# Altium project PCB_Project.PrjPcb
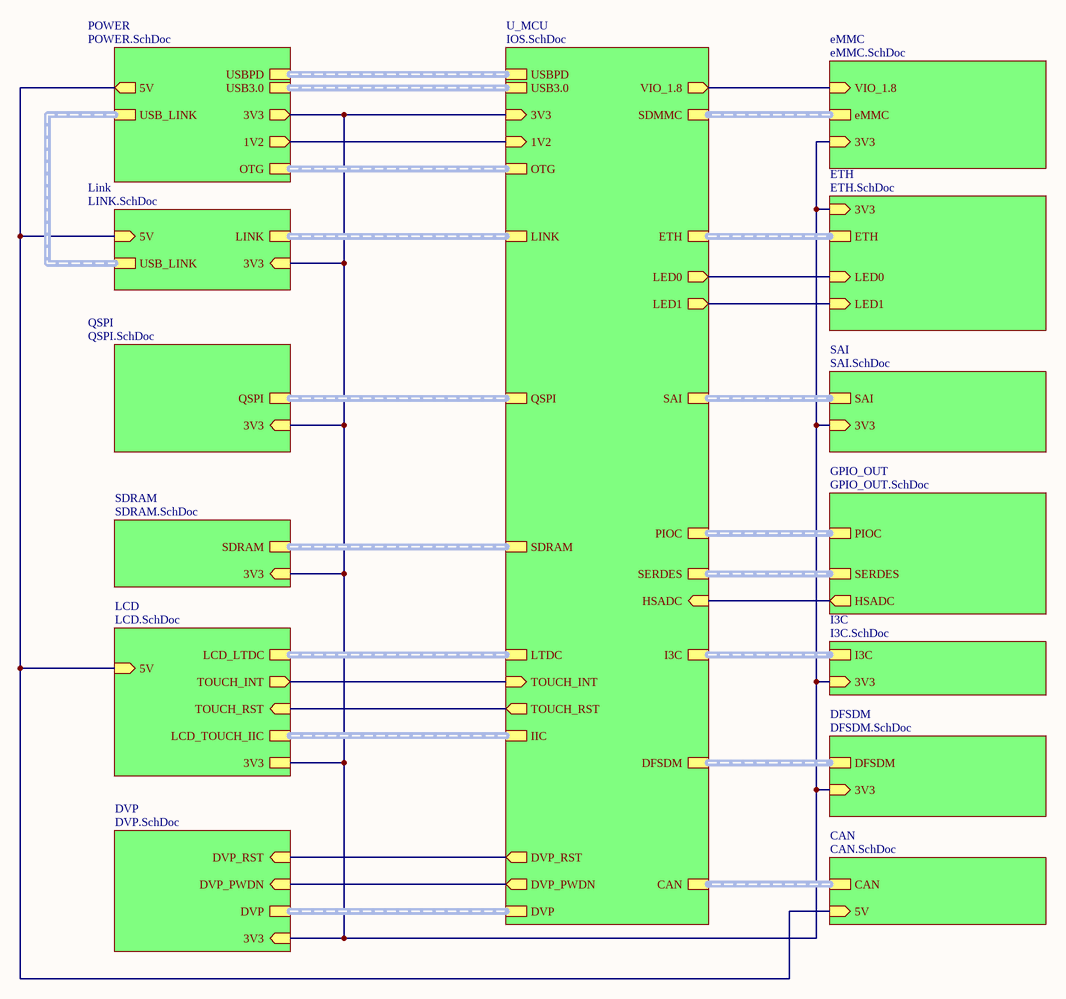
[diagram p0: TOP.SchDoc]
15 sheets, 263 parts. Net scope: hierarchical (ports join the sheet entries above them; power ports are global).
Sheets:
  TOP.SchDoc
    POWER = POWER.SchDoc
    U_MCU = IOS.SchDoc
    Link = LINK.SchDoc
    QSPI = QSPI.SchDoc
    SDRAM = SDRAM.SchDoc
    LCD = LCD.SchDoc
    eMMC = eMMC.SchDoc
    DVP = DVP.SchDoc
    ETH = ETH.SchDoc
    SAI = SAI.SchDoc
    I3C = I3C.SchDoc
    DFSDM = DFSDM.SchDoc
    CAN = CAN.SchDoc
    GPIO_OUT = GPIO_OUT.SchDoc

## Sheet TOP.SchDoc
size A3; DocumentNumber: 1; SheetNumber: 1; SheetTotal: 15

### Sub-sheets
CAN = CAN.SchDoc: CAN (harness CAN), 5V (in)
DFSDM = DFSDM.SchDoc: DFSDM (harness DFSDM), 3V3 (in)
DVP = DVP.SchDoc: DVP (harness DVP), DVP_RST (in), DVP_PWDN (in), 3V3 (in)
eMMC = eMMC.SchDoc: eMMC (harness eMMC), 3V3 (in), VIO_1.8 (in)
ETH = ETH.SchDoc: ETH (harness ETH), LED0 (in), LED1 (in), 3V3 (in)
GPIO_OUT = GPIO_OUT.SchDoc: PIOC (harness PIOC), SERDES (harness SERDES), HSADC (out)
I3C = I3C.SchDoc: I3C (harness I3C), 3V3 (in)
LCD = LCD.SchDoc: LCD_LTDC (harness LCD_LTDC), LCD_TOUCH_IIC (harness LCD_TOUCH_IIC), TOUCH_INT (out), TOUCH_RST (in), 3V3, 5V (in)
Link = LINK.SchDoc: LINK (harness LINK), USB_LINK (harness USB_LINK), 3V3 (in), 5V (in)
POWER = POWER.SchDoc: USB_LINK (harness USB_LINK), USB3.0 (harness USB3.0), 3V3 (out), 1V2 (out), OTG (harness OTG), 5V (out), USBPD (harness USBPD)
QSPI = QSPI.SchDoc: QSPI (harness QSPI), 3V3 (in)
SAI = SAI.SchDoc: SAI (harness SAI), 3V3 (in)
SDRAM = SDRAM.SchDoc: SDRAM (harness SDRAM), 3V3 (in)
U_MCU = IOS.SchDoc: QSPI (harness QSPI), LINK (harness LINK), SDRAM (harness SDRAM), LTDC (harness LCD_LTDC), USB3.0 (harness USB3.0), IIC (harness IIC), DVP (harness DVP), TOUCH_INT (in), TOUCH_RST (out), DVP_RST (out), DVP_PWDN (out), SDMMC (harness eMMC), ETH (harness ETH), SAI (harness SAI), I3C (harness I3C), DFSDM (harness DFSDM), 3V3 (in), 1V2 (in), LED0 (out), LED1 (out), VIO_1.8 (out), OTG (harness OTG), USBPD (harness USBPD), HSADC (in), PIOC (harness PIOC), SERDES (harness SERDES), CAN

### Nets
1V2: sheet POWER/1V2, sheet U_MCU/1V2
3V3: sheet POWER/3V3, sheet U_MCU/3V3, sheet Link/3V3, sheet QSPI/3V3, sheet SDRAM/3V3, sheet LCD/3V3, sheet eMMC/3V3, sheet DVP/3V3, sheet ETH/3V3, sheet SAI/3V3, sheet I3C/3V3, sheet DFSDM/3V3
5V: sheet POWER/5V, sheet Link/5V, sheet LCD/5V, sheet CAN/5V
VIO_1.8: sheet U_MCU/VIO_1.8, sheet eMMC/VIO_1.8
DVP_PWDN: sheet U_MCU/DVP_PWDN, sheet DVP/DVP_PWDN
DVP_RESET: sheet U_MCU/DVP_RST, sheet DVP/DVP_RST
ELED0: sheet U_MCU/LED0, sheet ETH/LED0
ELED1: sheet U_MCU/LED1, sheet ETH/LED1
HSADC: sheet U_MCU/HSADC, sheet GPIO_OUT/HSADC
TOUCH_INT: sheet U_MCU/TOUCH_INT, sheet LCD/TOUCH_INT
TOUCH_RST: sheet U_MCU/TOUCH_RST, sheet LCD/TOUCH_RST

### Buses and harness runs
harness sheet CAN/CAN = sheet U_MCU/CAN
harness sheet DFSDM/DFSDM = sheet U_MCU/DFSDM
harness sheet DVP/DVP = sheet U_MCU/DVP
harness sheet eMMC/eMMC = sheet U_MCU/SDMMC
harness sheet ETH/ETH = sheet U_MCU/ETH
harness sheet GPIO_OUT/PIOC = sheet U_MCU/PIOC
harness sheet GPIO_OUT/SERDES = sheet U_MCU/SERDES
harness sheet I3C/I3C = sheet U_MCU/I3C
harness sheet LCD/LCD_LTDC = sheet U_MCU/LTDC
harness sheet LCD/LCD_TOUCH_IIC = sheet U_MCU/IIC
harness sheet Link/LINK = sheet U_MCU/LINK
harness sheet Link/USB_LINK = sheet POWER/USB_LINK
harness sheet POWER/OTG = sheet U_MCU/OTG
harness sheet POWER/USB3.0 = sheet U_MCU/USB3.0
harness sheet POWER/USBPD = sheet U_MCU/USBPD
harness sheet QSPI/QSPI = sheet U_MCU/QSPI
harness sheet SAI/SAI = sheet U_MCU/SAI
harness sheet SDRAM/SDRAM = sheet U_MCU/SDRAM

## Sheet POWER.SchDoc: POWER
size A4; DocumentNumber: 2; SheetNumber: 2; SheetTotal: 15
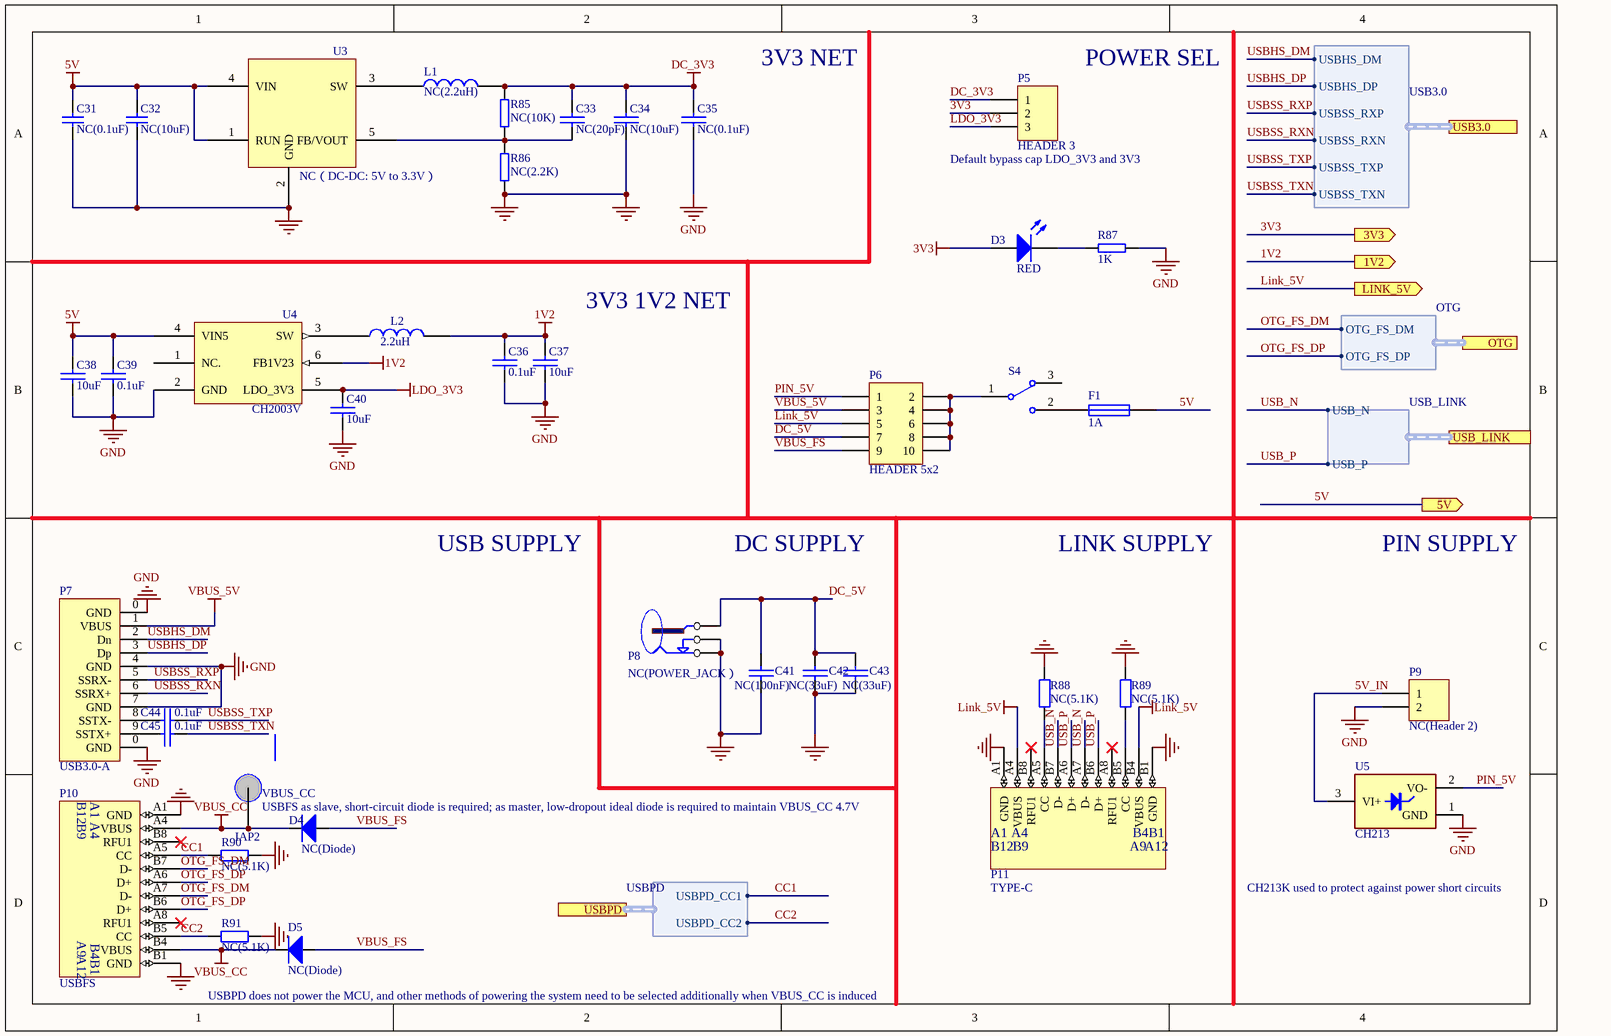
[diagram p1: POWER.SchDoc]

### Parts
C31  NC(0.1uF)  [0402_C]
C32  NC(10uF)  [0603_C]
C33  NC(20pF)  [0402_C]
C34  NC(10uF)  [0603_C]
C35  NC(0.1uF)  [0402_C]
C36  0.1uF  [0402_C]
C37  10uF  [0603_C]
C38  10uF  [0603_C]
C39  0.1uF  [0402_C]
C40  10uF  [0603_C]
C41  NC(100nF)  [0402_C]
C42  NC(33uF)  [3528_C]
C43  NC(33uF)  [3528_C]
C44  0.1uF  [0402_C]
C45  0.1uF  [0402_C]
D3  RED  [0603+]
D4  NC(Diode)  [SOD-323]
D5  NC(Diode)  [SOD-323]
F1  1A  [0805]
IAP2  VBUS_CC  [TESTPOINT1]
L1  NC(2.2uH)  [CD32]
L2  2.2uH  [CD32]
P5  HEADER 3  [SIP3-2.54MM]
P6  HEADER 5x2  [IDC10-2.54mm]
P7  USB3.0-A  [USB3.0-A-Receptacle]
P8  NC(POWER_JACK）  [DC-005]
P9  NC(Header 2)  [SIP2-2.54mm]
P10  USBFS  [TYPE-C-Receptacle-2.0]
P11  TYPE-C  [TYPE-C-Receptacle-2.0]
R85  NC(10K)  [0402]
R86  NC(2.2K)  [0402]
R87  1K  [0402]
R88  NC(5.1K)  [0402]
R89  NC(5.1K)  [0402]
R90  NC(5.1K)  [0402]
R91  NC(5.1K)  [0402]
S4  SW-SPDT  [SW1]  (value not drawn)
U3  NC（DC-DC: 5V to 3.3V）  [SOT-23-5]
U4  CH2003V  [SOT-23-6]
U5  CH213  [SOT-23-3]

### Ports
1V2 (out), 3V3 (out), 5V (out), LINK_5V (out), OTG (harness OTG), USB3.0 (harness USB3.0), USB_LINK (harness USB_LINK), USBPD (harness USBPD)

### Harnesses
USB_LINK: USB_P, USB_N
USB3.0: USBHS_DM, USBHS_DP, USBSS_RXP, USBSS_RXN, USBSS_TXP, USBSS_TXN
OTG: OTG_FS_DP, OTG_FS_DM
USBPD: USBPD_CC1, USBPD_CC2

### Nets
1V2: C36.2 C37.2 L2.2 U4.6(FB1V23) ; port 1V2
3V3: D3.1(A) P5.2 ; port 3V3
5V: C31.2 C32.2 C38.2 C39.2 F1.1 U3.1(RUN) U3.4(VIN) U4.4(VIN5) ; port 5V
DC_3V3: C33.1 C34.1 C35.1 L1.2 P5.1 R85.1
GND: C31.1 C32.1 C34.2 C35.2 C36.1 C37.1 C38.1 C39.1 C40.1 C41.1 C42.1 C43.1 P7.0(GND) P7.4(GND) P7.7(GND) P8.2(G) P8.3(X) P9.2 P10.A1(GND) P10.B1(GND) P11.A1(GND) P11.B1(GND) R86.1 R87.2 R88.2 R89.2 R90.2 R91.2 U3.2(GND) U4.2(GND) U5.1(GND)
LDO_3V3: C40.2 P5.3 U4.5(LDO_3V3)
Link_5V: P6.5 P11.A4(VBUS) P11.B4(VBUS) ; port LINK_5V
VBUS_5V: P6.3 P7.1(VBUS)
VBUS_CC: D4.2(K) D5.2(K) IAP2.1(point) P10.A4(VBUS) P10.B4(VBUS)
5V_IN: P9.1 U5.3(VI+)
CC1: P10.A5(CC) R90.1 ; port USBPD.USBPD_CC1
CC2: P10.B5(CC) R91.1 ; port USBPD.USBPD_CC2
DC_5V: C41.2 C42.2 C43.2 P6.7 P8.1(V)
OTG_FS_DM: P10.A7(D-) P10.B7(D-) ; port OTG.OTG_FS_DM
OTG_FS_DP: P10.A6(D+) P10.B6(D+) ; port OTG.OTG_FS_DP
PIN_5V: P6.1 U5.2(VO-)
USB_N: P11.A7(D-) P11.B7(D-) ; port USB_LINK.USB_N
USB_P: P11.A6(D+) P11.B6(D+) ; port USB_LINK.USB_P
USBHS_DM: P7.2(Dn) ; port USB3.0.USBHS_DM  [project net DIO]
USBHS_DP: P7.3(Dp) ; port USB3.0.USBHS_DP  [project net CLK]
USBSS_RXN: P7.6(SSRX+) ; port USB3.0.USBSS_RXN
USBSS_RXP: P7.5(SSRX-) ; port USB3.0.USBSS_RXP
USBSS_TXN: C45.2 ; port USB3.0.USBSS_TXN
USBSS_TXP: C44.2 ; port USB3.0.USBSS_TXP
VBUS_FS: D4.1(A) D5.1(A) P6.9
NetC33_2: C33.2 R85.2 R86.2 U3.5(FB/VOUT)
NetC44_1: C44.1 P7.8(SSTX-)
NetC45_1: C45.1 P7.9(SSTX+)
NetD3_2: D3.2(K) R87.1
NetF1_2: F1.2 S4.2
NetL1_1: L1.1 U3.3(SW)
NetL2_1: L2.1 U4.3(SW)
NetP6_2: P6.2 P6.4 P6.6 P6.8 P6.10 S4.1
NetP11_A5: P11.A5(CC) R88.1
NetP11_B5: P11.B5(CC) R89.1

Not connected (* = marked no-connect by the designer): P10 A8(RFU1)* B8(RFU1)*; P11 A8(RFU1)* B8(RFU1)*; S4 3; U4 1(NC.)

### Notes on the sheet
- (near U3) Hot!!!
- 3V3 NET
- POWER SEL
- (near P5) Default bypass cap LDO_3V3 and 3V3
- 3V3 1V2 NET
- USB SUPPLY
- DC SUPPLY
- LINK SUPPLY
- PIN SUPPLY
- USBFS as slave, short-circuit diode is required; as master, low-dropout ideal diode is required to maintain VBUS_CC 4.7V
- CH213K used to protect against power short circuits
- USBPD does not power the MCU, and other methods of powering the system need to be selected additionally when VBUS_CC is induced
- (in symbol TYPE-C1) B12; B9; A9; A12

### Library data of the parts
C31 C32 = Cap: Capacitor; Published: 8-Jun-2000; LatestRevisionDate: 17-Jul-2002; LatestRevisionNote: Re-released for DXP Platform.; PackageReference: RAD-0.3; Publisher: Altium Limited; PackageDescription: Radial Cap, Thru-Hole; 2 Leads; 0.3 in Pin Spacing
C33-C45 = CAP: Capacitor
  C41: 容值: 100nF
  C42 C43: 容值: 33uF
D3 = LED0: Typical INFRARED GaAs LED; Published: 8-Jun-2000; LatestRevisionDate: 08-Jul-2005; LatestRevisionNote: Mech Layer 1 removed.; PackageReference: LED-0; Publisher: Altium Limited; PackageDescription: LED; 2 Leads
D4 D5 = Diode: Default Diode
F1 = FUSE1: Fuse
IAP2 = Testpoint: 测试点
L1 L2 = INDUCTOR
P5 = HEADER 3: Header, 3-Pin
P6 = HEADER 5x2: Header, 5-Pin, Dual row
P8 = POWER_JACK
P9 = Header 2: Header, 2-Pin; Publisher: Altium Limited
P10 P11 = TYPE-C1
R85 R86 = R
R87 = RES
R88-R91 = Res2: Resistor
S4 = SW-SPDT: SPDT Subminiature Toggle Switch, Right Angle Mounting, Vertical Actuation
U3 = 8503AM
U4 = CH2003V: Step-Down DC-DC Converter, 5V input, 1.23V * 700mA output, with LDO 3.3V * 160mA
U5 = CH213E: Ideal Diode 5V*1A

## Sheet IOS.SchDoc
size A3; DocumentNumber: 3; SheetNumber: 3; SheetTotal: 15
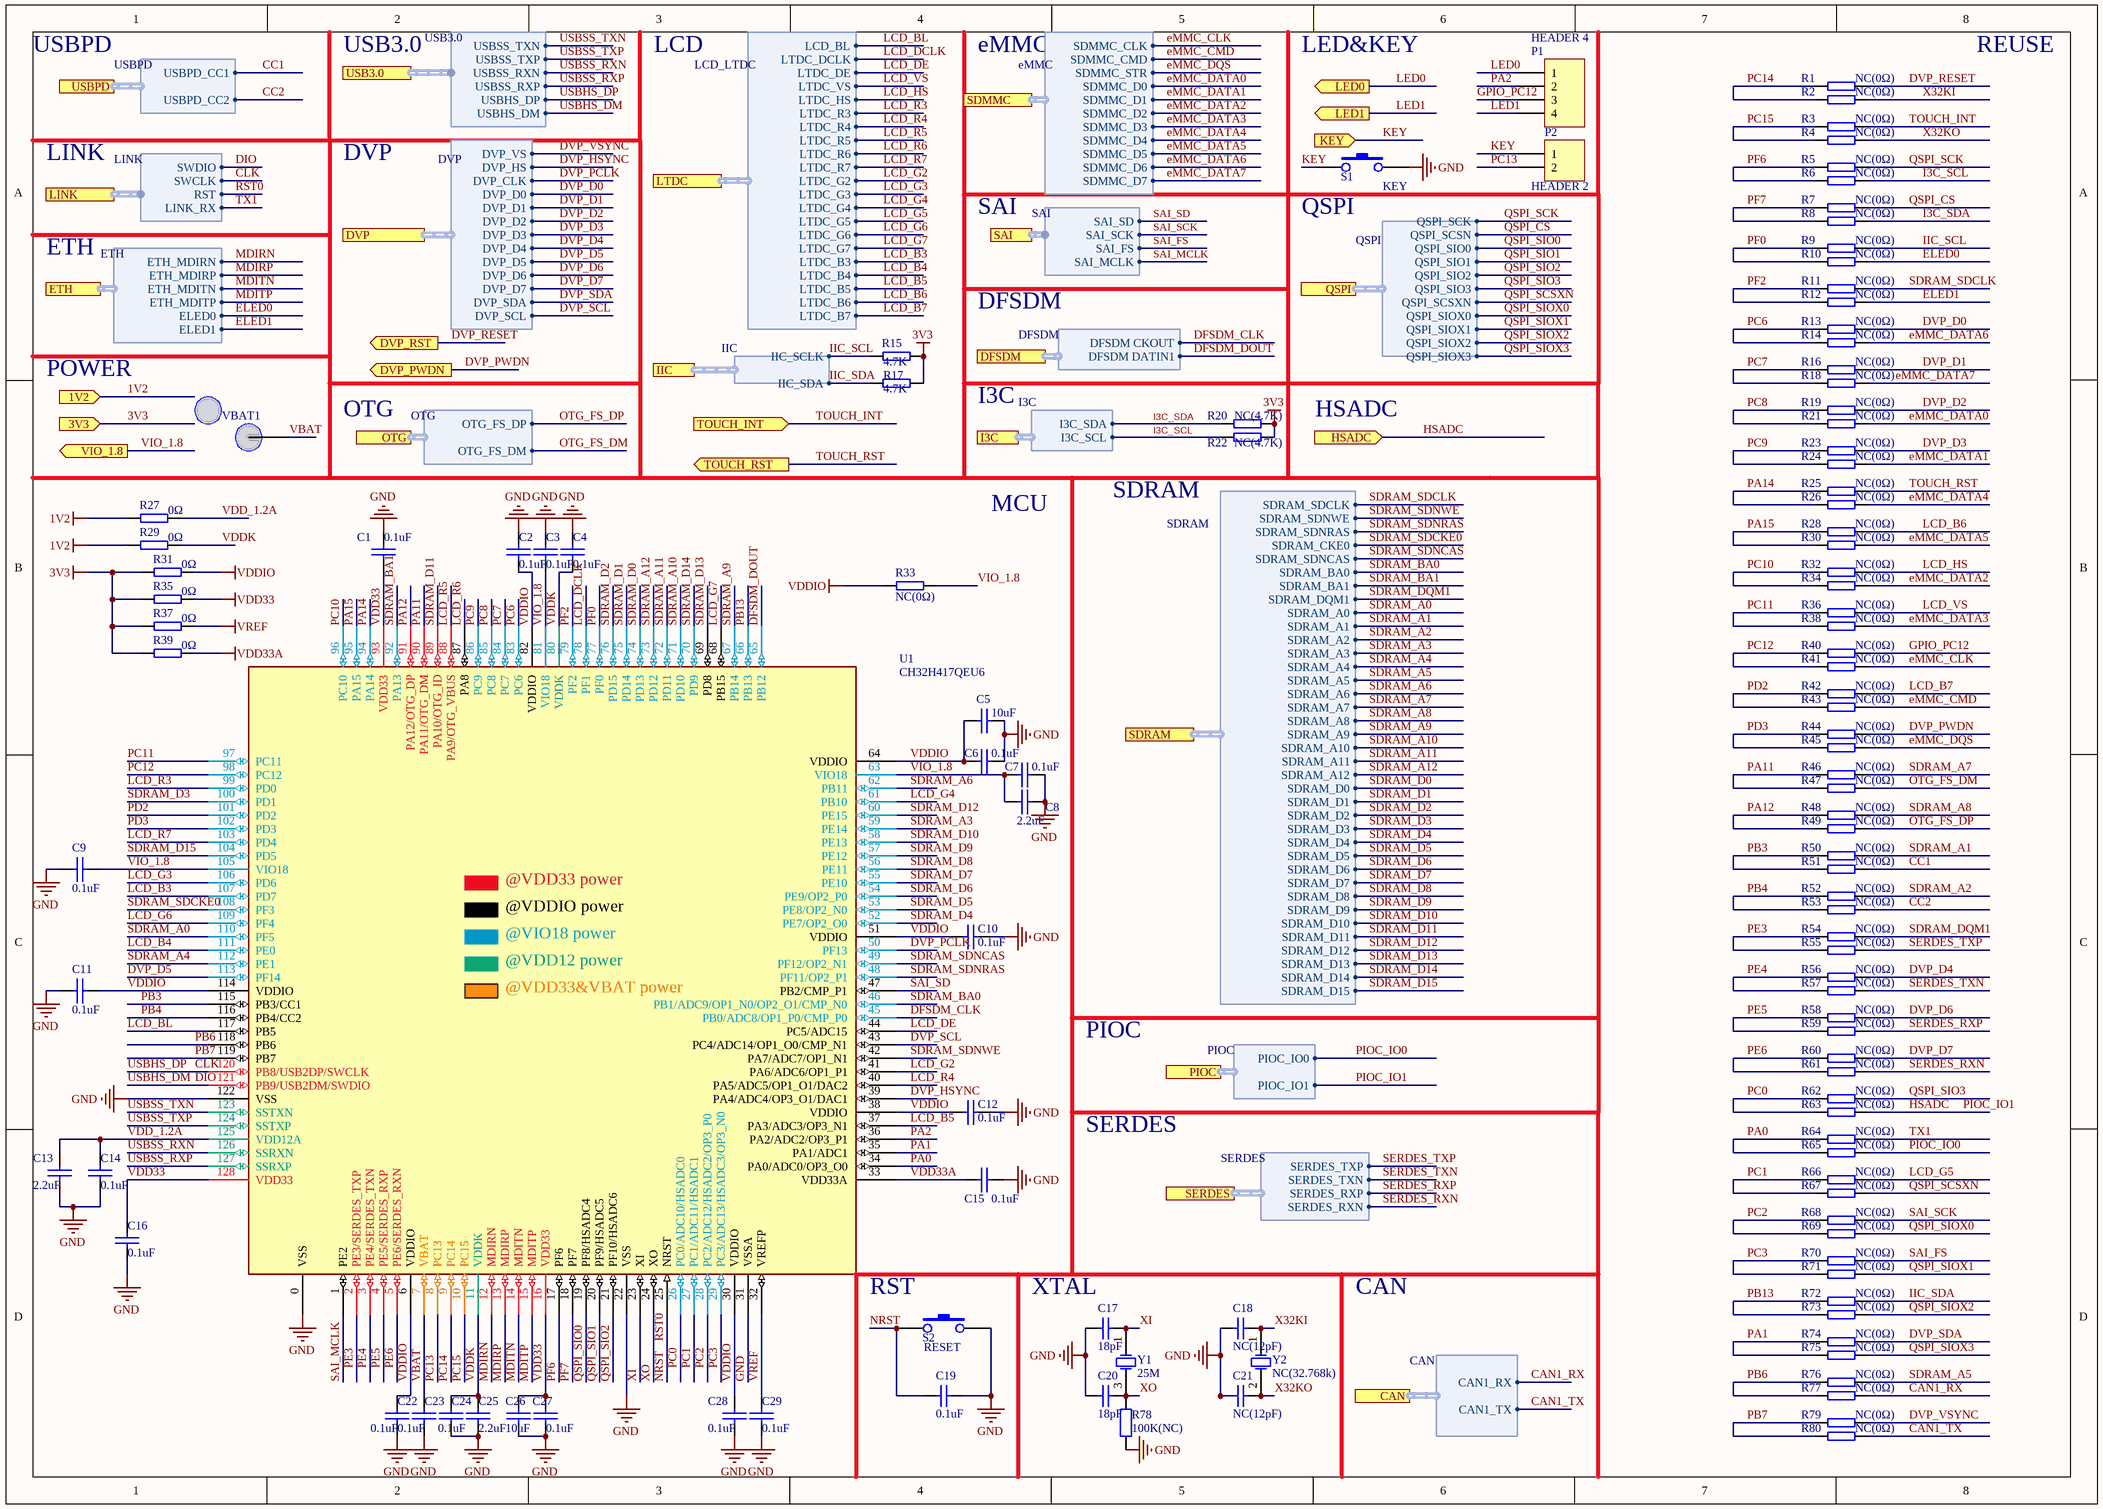
[diagram p2: IOS.SchDoc]

### Parts
C1  0.1uF  [0402_C]
C2  0.1uF  [0402_C]
C3  0.1uF  [0402_C]
C4  0.1uF  [0402_C]
C5  10uF  [0402_C]
C6  0.1uF  [0402_C]
C7  0.1uF  [0402_C]
C8  2.2uF  [0402_C]
C9  0.1uF  [0402_C]
C10  0.1uF  [0402_C]
C11  0.1uF  [0402_C]
C12  0.1uF  [0402_C]
C13  2.2uF  [0402_C]
C14  0.1uF  [0402_C]
C15  0.1uF  [0402_C]
C16  0.1uF  [0402_C]
C17  18pF  [0402_C]
C18  NC(12pF)  [0402_C]
C19  0.1uF  [0402_C]
C20  18pF  [0402_C]
C21  NC(12pF)  [0402_C]
C22  0.1uF  [0402_C]
C23  0.1uF  [0402_C]
C24  0.1uF  [0402_C]
C25  2.2uF  [0402_C]
C26  10uF  [0402_C]
C27  0.1uF  [0402_C]
C28  0.1uF  [0402_C]
C29  0.1uF  [0402_C]
P1  HEADER 4  [SIP4-2.54mm]
P2  HEADER 2  [SIP2-2.54mm]
R1  NC(0Ω)  [0402]
R2  NC(0Ω)  [0402]
R3  NC(0Ω)  [0402]
R4  NC(0Ω)  [0402]
R5  NC(0Ω)  [0402]
R6  NC(0Ω)  [0402]
R7  NC(0Ω)  [0402]
R8  NC(0Ω)  [0402]
R9  NC(0Ω)  [0402]
R10  NC(0Ω)  [0402]
R11  NC(0Ω)  [0402]
R12  NC(0Ω)  [0402]
R13  NC(0Ω)  [0402]
R14  NC(0Ω)  [0402]
R15  4.7K  [0402]
R16  NC(0Ω)  [0402]
R17  4.7K  [0402]
R18  NC(0Ω)  [0402]
R19  NC(0Ω)  [0402]
R20  NC(4.7K)  [0402]
R21  NC(0Ω)  [0402]
R22  NC(4.7K)  [0402]
R23  NC(0Ω)  [0402]
R24  NC(0Ω)  [0402]
R25  NC(0Ω)  [0402]
R26  NC(0Ω)  [0402]
R27  0Ω  [0402]
R28  NC(0Ω)  [0402]
R29  0Ω  [0402]
R30  NC(0Ω)  [0402]
R31  0Ω  [0402]
R32  NC(0Ω)  [0402]
R33  NC(0Ω)  [0402]
R34  NC(0Ω)  [0402]
R35  0Ω  [0402]
R36  NC(0Ω)  [0402]
R37  0Ω  [0402]
R38  NC(0Ω)  [0402]
R39  0Ω  [0402]
R40  NC(0Ω)  [0402]
R41  NC(0Ω)  [0402]
R42  NC(0Ω)  [0402]
R43  NC(0Ω)  [0402]
R44  NC(0Ω)  [0402]
R45  NC(0Ω)  [0402]
R46  NC(0Ω)  [0402]
R47  NC(0Ω)  [0402]
R48  NC(0Ω)  [0402]
R49  NC(0Ω)  [0402]
R50  NC(0Ω)  [0402]
R51  NC(0Ω)  [0402]
R52  NC(0Ω)  [0402]
R53  NC(0Ω)  [0402]
R54  NC(0Ω)  [0402]
R55  NC(0Ω)  [0402]
R56  NC(0Ω)  [0402]
R57  NC(0Ω)  [0402]
R58  NC(0Ω)  [0402]
R59  NC(0Ω)  [0402]
R60  NC(0Ω)  [0402]
R61  NC(0Ω)  [0402]
R62  NC(0Ω)  [0402]
R63  NC(0Ω)  [0402]
R64  NC(0Ω)  [0402]
R65  NC(0Ω)  [0402]
R66  NC(0Ω)  [0402]
R67  NC(0Ω)  [0402]
R68  NC(0Ω)  [0402]
R69  NC(0Ω)  [0402]
R70  NC(0Ω)  [0402]
R71  NC(0Ω)  [0402]
R72  NC(0Ω)  [0402]
R73  NC(0Ω)  [0402]
R74  NC(0Ω)  [0402]
R75  NC(0Ω)  [0402]
R76  NC(0Ω)  [0402]
R77  NC(0Ω)  [0402]
R78  100K(NC)  [0402]
R79  NC(0Ω)  [0402]
R80  NC(0Ω)  [0402]
S1  KEY  [贴片按键]
S2  RESET  [贴片按键]
U1  CH32H417QEU6  [QFN128_12.3X12.3]
VBAT1  Testpoint  [TESTPOINT2]  (value not drawn)
Y1  25M  [XT3225]
Y2  NC(32.768k)  [FC-135]

### Ports
1V2 (in), 3V3 (in), CAN (harness CAN), DFSDM (harness DFSDM), DVP (harness DVP), DVP_PWDN (out), DVP_RST (out), ETH (harness ETH), HSADC (in), I3C (harness I3C), IIC (harness IIC), KEY (in), LED0 (out), LED1 (out), LINK (harness LINK), LTDC (harness LCD_LTDC), OTG (harness OTG), PIOC (harness PIOC), QSPI (harness QSPI), SAI (harness SAI), SDMMC (harness eMMC), SDRAM (harness SDRAM), SERDES (harness SERDES), TOUCH_INT (in), TOUCH_RST (out), USB3.0 (harness USB3.0), USBPD (harness USBPD), VIO_1.8 (out)

### Harnesses
QSPI: QSPI_SCK, QSPI_SCSN, QSPI_SIO0, QSPI_SIO1, QSPI_SIO2, QSPI_SIO3, QSPI_SCSXN, QSPI_SIOX0, QSPI_SIOX1, QSPI_SIOX2, QSPI_SIOX3
USB3.0: USBHS_DM, USBHS_DP, USBSS_RXP, USBSS_RXN, USBSS_TXP, USBSS_TXN
SDRAM: SDRAM_SDNWE, SDRAM_SDNRAS, SDRAM_CKE0, SDRAM_SDNCAS, SDRAM_BA0, SDRAM_BA1, SDRAM_DQM1, SDRAM_A0, SDRAM_A1, SDRAM_A2, SDRAM_A3, SDRAM_A4, SDRAM_A5, SDRAM_A6, SDRAM_A7, SDRAM_A8, SDRAM_A9, SDRAM_A10, SDRAM_A11, SDRAM_A12, SDRAM_SDCLK, SDRAM_D0, SDRAM_D2, SDRAM_D3, SDRAM_D4, SDRAM_D5, SDRAM_D6, SDRAM_D7, SDRAM_D8, SDRAM_D9, SDRAM_D10, SDRAM_D11, SDRAM_D12, SDRAM_D13, SDRAM_D14, SDRAM_D15, SDRAM_D1
IIC: IIC_SCLK, IIC_SDA
LCD_LTDC: LCD_BL, LTDC_DCLK, LTDC_DE, LTDC_VS, LTDC_HS, LTDC_R3, LTDC_R4, LTDC_R5, LTDC_R6, LTDC_R7, LTDC_G2, LTDC_G3, LTDC_G4, LTDC_G5, LTDC_G6, LTDC_G7, LTDC_B3, LTDC_B4, LTDC_B5, LTDC_B6, LTDC_B7
DVP: DVP_VS, DVP_HS, DVP_CLK, DVP_D0, DVP_D1, DVP_D2, DVP_D3, DVP_D4, DVP_D5, DVP_D6, DVP_D7, DVP_SDA, DVP_SCL
eMMC: SDMMC_CLK, SDMMC_CMD, SDMMC_STR, SDMMC_D1, SDMMC_D0, SDMMC_D2, SDMMC_D3, SDMMC_D4, SDMMC_D5, SDMMC_D6, SDMMC_D7
LINK: SWDIO, SWCLK, RST, LINK_RX
ETH: ETH_MDIRN, ETH_MDIRP, ETH_MDITN, ETH_MDITP, ELED0, ELED1
DFSDM: DFSDM CKOUT, DFSDM DATIN1
SAI: SAI_SD, SAI_SCK, SAI_FS, SAI_MCLK
I3C: I3C_SDA, I3C_SCL
OTG: OTG_FS_DP, OTG_FS_DM
PIOC: PIOC_IO0, PIOC_IO1
SERDES: SERDES_TXP, SERDES_TXN, SERDES_RXP, SERDES_RXN
USBPD: USBPD_CC1, USBPD_CC2
CAN: CAN1_TX, CAN1_RX

### Nets
1V2: R27.2 R29.2 ; port 1V2
3V3: R15.2 R17.1 R20.2 R22.1 R31.2 R35.2 R37.2 R39.2 ; port 3V3
GND: C1.2 C2.2 C3.2 C4.2 C5.1 C6.2 C7.2 C8.1 C9.2 C10.2 C11.1 C12.1 C13.1 C14.1 C15.1 C16.1 C17.1 C18.2 C19.1 C20.1 C21.2 C22.1 C23.1 C24.1 C25.2 C26.1 C27.1 C28.2 C29.1 R78.1 S1.2 S2.2 U1.0(VSS) U1.22(VSS) U1.31(VSSA) U1.122(VSS)
VDD33: C1.1 C16.2 C26.2 C27.2 R35.1 U1.16(VDD33) U1.93(VDD33) U1.128(VDD33)
VDD33A: C15.2 R39.1 U1.33(VDD33A)
VDDIO: C2.1 C5.2 C6.1 C10.1 C11.2 C12.2 C22.2 C28.1 R31.1 R33.2 U1.6(VDDIO) U1.30(VDDIO) U1.38(VDDIO) U1.51(VDDIO) U1.64(VDDIO) U1.82(VDDIO) U1.114(VDDIO)
VIO_1.8: C3.1 C7.1 C8.2 C9.1 R33.1 U1.63(VIO18) U1.81(VIO18) U1.105(VIO18) ; port VIO_1.8
VREF: C29.2 R37.1 U1.32(VREFP)
CAN1_RX: R77.1 ; port CAN.CAN1_RX
CAN1_TX: R80.1 ; port CAN.CAN1_TX
CC1: R51.1 ; port USBPD.USBPD_CC1
CC2: R53.1 ; port USBPD.USBPD_CC2
CLK: U1.120(PB8/USB2DP/SWCLK) ; port USB3.0.USBHS_DP, port LINK.SWCLK  [also labelled USBHS_DP]
DFSDM_CLK: U1.45(PB0/ADC8/OP1_P0/CMP_P0) ; port DFSDM.DFSDM CKOUT  [project net DFS_CLK]
DFSDM_DOUT: U1.65(PB12) ; port DFSDM.DFSDM DATIN1  [project net DFS_DOUT]
DIO: U1.121(PB9/USB2DM/SWDIO) ; port USB3.0.USBHS_DM, port LINK.SWDIO  [also labelled USBHS_DM]
DVP_D0: R13.1 ; port DVP.DVP_D0
DVP_D1: R16.1 ; port DVP.DVP_D1
DVP_D2: R19.1 ; port DVP.DVP_D2
DVP_D3: R23.1 ; port DVP.DVP_D3
DVP_D4: R56.1 ; port DVP.DVP_D4
DVP_D5: U1.113(PF14) ; port DVP.DVP_D5
DVP_D6: R58.1 ; port DVP.DVP_D6
DVP_D7: R60.1 ; port DVP.DVP_D7
DVP_HSYNC: U1.39(PA4/ADC4/OP3_O1/DAC1) ; port DVP.DVP_HS
DVP_PCLK: U1.50(PF13) ; port DVP.DVP_CLK
DVP_PWDN: R44.1 ; port DVP_PWDN
DVP_RESET: R1.1 ; port DVP_RST
DVP_SCL: U1.43(PC4/ADC14/OP1_O0/CMP_N1) ; port DVP.DVP_SCL
DVP_SDA: R74.1 ; port DVP.DVP_SDA
DVP_VSYNC: R79.1 ; port DVP.DVP_VS
ELED0: P1.1 R10.1 ; port LED0, port ETH.ELED0  [also labelled LED0]
ELED1: P1.4 R12.1 ; port LED1, port ETH.ELED1  [also labelled LED1]
eMMC_CLK: R41.1 ; port SDMMC.SDMMC_CLK
eMMC_CMD: R43.1 ; port SDMMC.SDMMC_CMD
eMMC_DATA0: R21.1 ; port SDMMC.SDMMC_D0
eMMC_DATA1: R24.1 ; port SDMMC.SDMMC_D1
eMMC_DATA2: R34.1 ; port SDMMC.SDMMC_D2
eMMC_DATA3: R38.1 ; port SDMMC.SDMMC_D3
eMMC_DATA4: R26.1 ; port SDMMC.SDMMC_D4
eMMC_DATA5: R30.1 ; port SDMMC.SDMMC_D5
eMMC_DATA6: R14.1 ; port SDMMC.SDMMC_D6
eMMC_DATA7: R18.1 ; port SDMMC.SDMMC_D7
eMMC_DQS: R45.1 ; port SDMMC.SDMMC_STR
GPIO_PC12: P1.3 R40.1
HSADC: R63.1 ; port HSADC, port PIOC.PIOC_IO1  [also labelled PIOC_IO1]
I3C_SCL: R6.1 R22.2 ; port I3C.I3C_SCL
I3C_SDA: R8.1 R20.1 ; port I3C.I3C_SDA
IIC_SCL: R9.1 R15.1 ; port IIC.IIC_SCLK
IIC_SDA: R17.2 R72.1 ; port IIC.IIC_SDA
KEY: P2.1 S1.1 ; port KEY
LCD_B3: U1.107(PD7) ; port LTDC.LTDC_B3
LCD_B4: U1.111(PE0) ; port LTDC.LTDC_B4
LCD_B5: U1.37(PA3/ADC3/OP3_N1) ; port LTDC.LTDC_B5
LCD_B6: R28.1 ; port LTDC.LTDC_B6
LCD_B7: R42.1 ; port LTDC.LTDC_B7
LCD_BL: U1.117(PB5) ; port LTDC.LCD_BL
LCD_DCLK: U1.78(PF1) ; port LTDC.LTDC_DCLK
LCD_DE: U1.44(PC5/ADC15) ; port LTDC.LTDC_DE
LCD_G2: U1.41(PA6/ADC6/OP1_P1) ; port LTDC.LTDC_G2
LCD_G3: U1.106(PD6) ; port LTDC.LTDC_G3
LCD_G4: U1.61(PB10) ; port LTDC.LTDC_G4
LCD_G5: R66.1 ; port LTDC.LTDC_G5
LCD_G6: U1.109(PF4) ; port LTDC.LTDC_G6
LCD_G7: U1.68(PB15) ; port LTDC.LTDC_G7
LCD_HS: R32.1 ; port LTDC.LTDC_HS
LCD_R3: U1.99(PD0) ; port LTDC.LTDC_R3
LCD_R4: U1.40(PA5/ADC5/OP1_O1/DAC2) ; port LTDC.LTDC_R4
LCD_R5: U1.88(PA9/OTG_VBUS) ; port LTDC.LTDC_R5
LCD_R6: U1.87(PA8) ; port LTDC.LTDC_R6
LCD_R7: U1.103(PD4) ; port LTDC.LTDC_R7
LCD_VS: R36.1 ; port LTDC.LTDC_VS
MDIRN: U1.12(MDIRN) ; port ETH.ETH_MDIRN
MDIRP: U1.13(MDIRP) ; port ETH.ETH_MDIRP
MDITN: U1.14(MDITN) ; port ETH.ETH_MDITN
MDITP: U1.15(MDITP) ; port ETH.ETH_MDITP
NRST: C19.2 S2.1 U1.25(NRST) ; port LINK.RST  [also labelled RST0]
OTG_FS_DM: R47.1 ; port OTG.OTG_FS_DM
OTG_FS_DP: R49.1 ; port OTG.OTG_FS_DP
PA0: R64.2 R65.2 U1.34(PA0/ADC0/OP3_O0)
PA1: R74.2 R75.2 U1.35(PA1/ADC1)
PA2: P1.2 U1.36(PA2/ADC2/OP3_P1)
PA11: R46.2 R47.2 U1.90(PA11/OTG_DM)
PA12: R48.2 R49.2 U1.91(PA12/OTG_DP)
PA14: R25.2 R26.2 U1.94(PA14)
PA15: R28.2 R30.2 U1.95(PA15)
PB3: R50.2 R51.2 U1.115(PB3/CC1)
PB4: R52.2 R53.2 U1.116(PB4/CC2)
PB6: R76.2 R77.2 U1.118(PB6)
PB7: R79.2 R80.2 U1.119(PB7)
PB13: R72.2 R73.2 U1.66(PB13)
PC0: R62.2 R63.2 U1.26(PC0/ADC10/HSADC0)
PC1: R66.2 R67.2 U1.27(PC1/ADC11/HSADC1)
PC2: R68.2 R69.2 U1.28(PC2/ADC12/HSADC2/OP3_P0)
PC3: R70.2 R71.2 U1.29(PC3/ADC13/HSADC3/OP3_N0)
PC6: R13.2 R14.2 U1.83(PC6)
PC7: R16.2 R18.2 U1.84(PC7)
PC8: R19.2 R21.2 U1.85(PC8)
PC9: R23.2 R24.2 U1.86(PC9)
PC10: R32.2 R34.2 U1.96(PC10)
PC11: R36.2 R38.2 U1.97(PC11)
PC12: R40.2 R41.2 U1.98(PC12)
PC13: P2.2 U1.8(PC13)
PC14: R1.2 R2.2 U1.9(PC14)
PC15: R3.2 R4.2 U1.10(PC15)
PD2: R42.2 R43.2 U1.101(PD2)
PD3: R44.2 R45.2 U1.102(PD3)
PE3: R54.2 R55.2 U1.2(PE3/SERDES_TXP)
PE4: R56.2 R57.2 U1.3(PE4/SERDES_TXN)
PE5: R58.2 R59.2 U1.4(PE5/SERDES_RXP)
PE6: R60.2 R61.2 U1.5(PE6/SERDES_RXN)
PF0: R9.2 R10.2 U1.77(PF0)
PF2: R11.2 R12.2 U1.79(PF2)
PF6: R5.2 R6.2 U1.17(PF6)
PF7: R7.2 R8.2 U1.18(PF7)
PIOC_IO0: R65.1 ; port PIOC.PIOC_IO0
QSPI_CS: R7.1 ; port QSPI.QSPI_SCSN
QSPI_SCK: R5.1 ; port QSPI.QSPI_SCK
QSPI_SCSXN: R67.1 ; port QSPI.QSPI_SCSXN
QSPI_SIO0: U1.19(PF8/HSADC4) ; port QSPI.QSPI_SIO0
QSPI_SIO1: U1.20(PF9/HSADC5) ; port QSPI.QSPI_SIO1
QSPI_SIO2: U1.21(PF10/HSADC6) ; port QSPI.QSPI_SIO2
QSPI_SIO3: R62.1 ; port QSPI.QSPI_SIO3
QSPI_SIOX0: R69.1 ; port QSPI.QSPI_SIOX0
QSPI_SIOX1: R71.1 ; port QSPI.QSPI_SIOX1
QSPI_SIOX2: R73.1 ; port QSPI.QSPI_SIOX2
QSPI_SIOX3: R75.1 ; port QSPI.QSPI_SIOX3
SAI_FS: R70.1 ; port SAI.SAI_FS
SAI_MCLK: U1.1(PE2) ; port SAI.SAI_MCLK
SAI_SCK: R68.1 ; port SAI.SAI_SCK
SAI_SD: U1.47(PB2/CMP_P1) ; port SAI.SAI_SD
SDRAM_A0: U1.110(PF5) ; port SDRAM.SDRAM_A0
SDRAM_A1: R50.1 ; port SDRAM.SDRAM_A1
SDRAM_A2: R52.1 ; port SDRAM.SDRAM_A2
SDRAM_A3: U1.59(PE14) ; port SDRAM.SDRAM_A3
SDRAM_A4: U1.112(PE1) ; port SDRAM.SDRAM_A4
SDRAM_A5: R76.1 ; port SDRAM.SDRAM_A5
SDRAM_A6: U1.62(PB11) ; port SDRAM.SDRAM_A6
SDRAM_A7: R46.1 ; port SDRAM.SDRAM_A7
SDRAM_A8: R48.1 ; port SDRAM.SDRAM_A8
SDRAM_A9: U1.67(PB14) ; port SDRAM.SDRAM_A9
SDRAM_A10: U1.71(PD10) ; port SDRAM.SDRAM_A10
SDRAM_A11: U1.72(PD11) ; port SDRAM.SDRAM_A11
SDRAM_A12: U1.73(PD12) ; port SDRAM.SDRAM_A12
SDRAM_BA0: U1.46(PB1/ADC9/OP1_N0/OP2_O1/CMP_N0) ; port SDRAM.SDRAM_BA0
SDRAM_BA1: U1.92(PA13) ; port SDRAM.SDRAM_BA1
SDRAM_D0: U1.74(PD13) ; port SDRAM.SDRAM_D0
SDRAM_D1: U1.75(PD14) ; port SDRAM.SDRAM_D1
SDRAM_D2: U1.76(PD15) ; port SDRAM.SDRAM_D2
SDRAM_D3: U1.100(PD1) ; port SDRAM.SDRAM_D3
SDRAM_D4: U1.52(PE7/OP2_O0) ; port SDRAM.SDRAM_D4
SDRAM_D5: U1.53(PE8/OP2_N0) ; port SDRAM.SDRAM_D5
SDRAM_D6: U1.54(PE9/OP2_P0) ; port SDRAM.SDRAM_D6
SDRAM_D7: U1.55(PE10) ; port SDRAM.SDRAM_D7
SDRAM_D8: U1.56(PE11) ; port SDRAM.SDRAM_D8
SDRAM_D9: U1.57(PE12) ; port SDRAM.SDRAM_D9
SDRAM_D10: U1.58(PE13) ; port SDRAM.SDRAM_D10
SDRAM_D11: U1.89(PA10/OTG_ID) ; port SDRAM.SDRAM_D11
SDRAM_D12: U1.60(PE15) ; port SDRAM.SDRAM_D12
SDRAM_D13: U1.69(PD8) ; port SDRAM.SDRAM_D13
SDRAM_D14: U1.70(PD9) ; port SDRAM.SDRAM_D14
SDRAM_D15: U1.104(PD5) ; port SDRAM.SDRAM_D15
SDRAM_DQM1: R54.1 ; port SDRAM.SDRAM_DQM1
SDRAM_SDCKE0: U1.108(PF3) ; port SDRAM.SDRAM_CKE0
SDRAM_SDCLK: R11.1 ; port SDRAM.SDRAM_SDCLK
SDRAM_SDNCAS: U1.49(PF12/OP2_N1) ; port SDRAM.SDRAM_SDNCAS
SDRAM_SDNRAS: U1.48(PF11/OP2_P1) ; port SDRAM.SDRAM_SDNRAS
SDRAM_SDNWE: U1.42(PA7/ADC7/OP1_N1) ; port SDRAM.SDRAM_SDNWE
SERDES_RXN: R61.1 ; port SERDES.SERDES_RXN
SERDES_RXP: R59.1 ; port SERDES.SERDES_RXP
SERDES_TXN: R57.1 ; port SERDES.SERDES_TXN
SERDES_TXP: R55.1 ; port SERDES.SERDES_TXP
TOUCH_INT: R3.1 ; port TOUCH_INT
TOUCH_RST: R25.1 ; port TOUCH_RST
TX1: R64.1 ; port LINK.LINK_RX
USBSS_RXN: U1.126(SSRXN) ; port USB3.0.USBSS_RXN
USBSS_RXP: U1.127(SSRXP) ; port USB3.0.USBSS_RXP
USBSS_TXN: U1.123(SSTXN) ; port USB3.0.USBSS_TXN
USBSS_TXP: U1.124(SSTXP) ; port USB3.0.USBSS_TXP
VBAT: C23.2 U1.7(VBAT) VBAT1.1(point)
VDD_1.2A: C13.2 C14.2 R27.1 U1.125(VDD12A)
VDDK: C4.1 C24.2 C25.1 R29.1 U1.11(VDDK) U1.80(VDDK)
X32KI: C18.1 R2.1 Y2.1(OSC1)
X32KO: C21.1 R4.1 Y2.2(OSC2)
XI: C17.2 U1.23(XI) Y1.1(OSC1)
XO: C20.2 R78.2 U1.24(XO) Y1.3(OSC2)

### Notes on the sheet
- USBPD
- USB3.0
- LCD
- eMMC
- LED&KEY
- REUSE
- LINK
- DVP
- SAI
- (near S1) QSPI
- ETH
- DFSDM
- POWER
- OTG
- I3C
- HSADC
- MCU
- SDRAM
- PIOC
- SERDES
- (near U1) RST
- (near C17) XTAL
- CAN
- (in symbol CH32H417QET6) @VDD33 power; @VDDIO power; @VIO18 power; @VDD12 power; @VDD33&VBAT power

### Library data of the parts
C1-C16 C22-C29 = CAP: Capacitor
C17-C21 = Cap: Capacitor
P1 = HEADER 4: Header, 4-Pin
P2 = HEADER 2: Header, 2-Pin
R1-R77 R79 R80 = RES
R78 = Res2: Resistor
S1 S2 = KEY1
U1 = CH32H417QET6: RISC-V FPU HD-MCU, 384MHz, USB3.0 & PD, 100M Ethernet, DVP, SDMMC, QSPI, OPA, ADC, DAC
VBAT1 = Testpoint: 测试点
Y1 Y2 = XTAL: Crystal Oscillator; Published: 8-Jun-2000; LatestRevisionDate: 17-Jul-2002; LatestRevisionNote: Re-released for DXP Platform.; PackageReference: R38; Publisher: Altium Limited

## Sheet LINK.SchDoc
size A4; DocumentNumber: 4; SheetNumber: 4; SheetTotal: 15
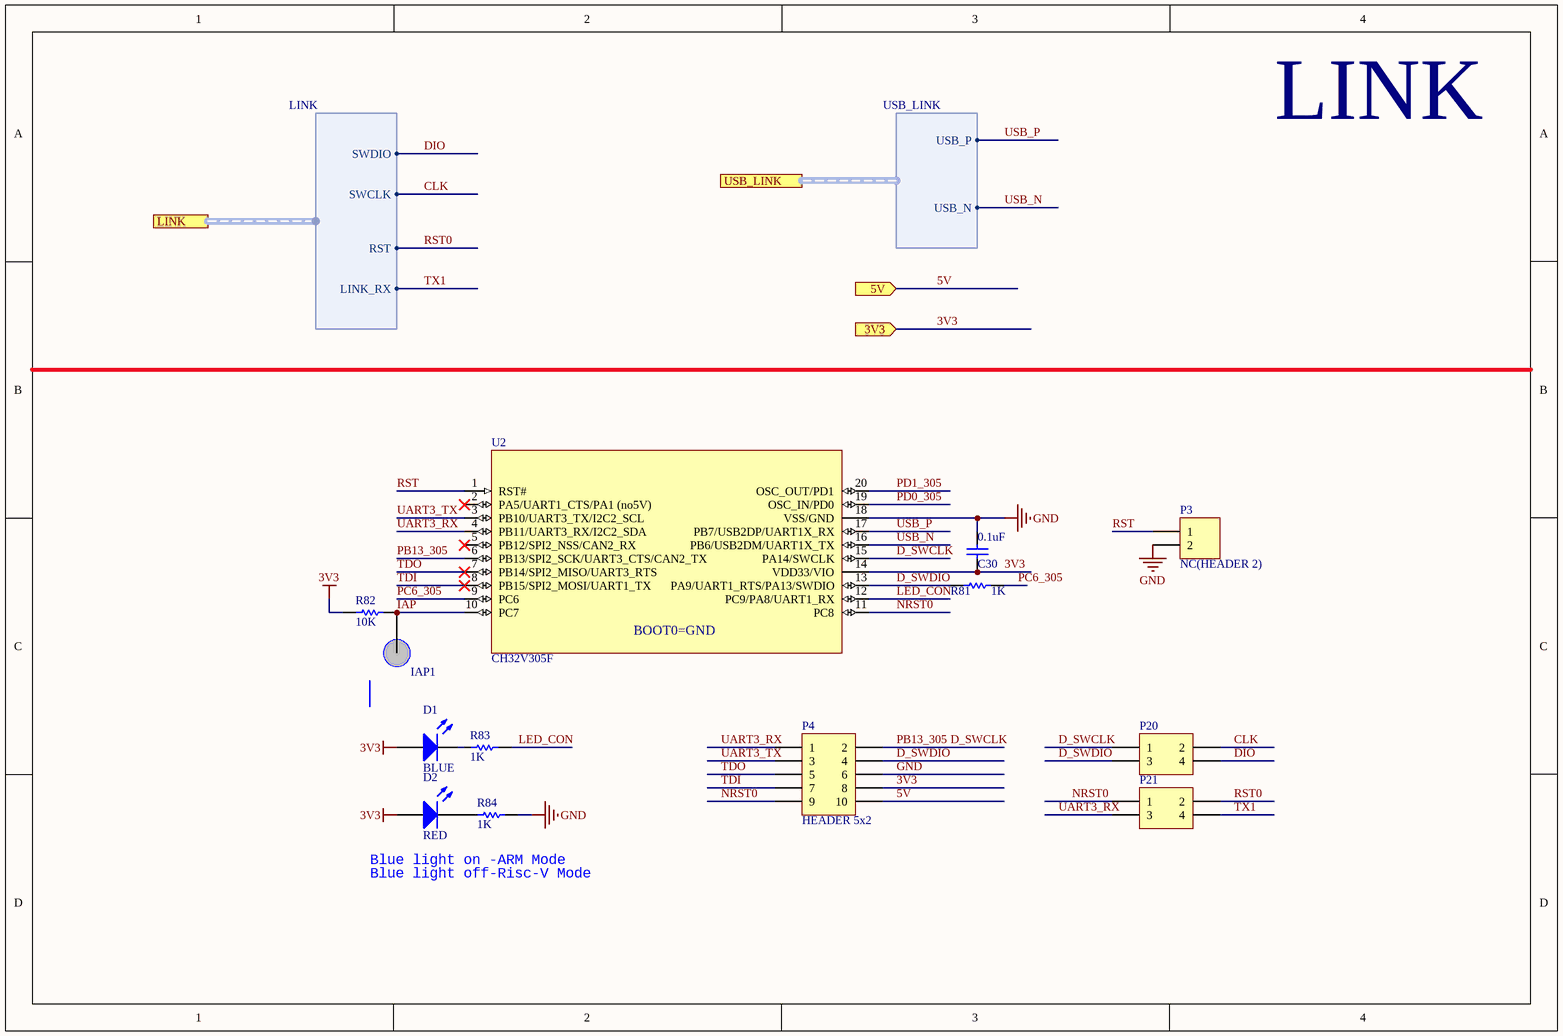
[diagram p3: LINK.SchDoc]

### Parts
C30  0.1uF  [0402_C]
D1  BLUE  [0603+]
D2  RED  [0603+]
IAP1  Testpoint  [TESTPOINT1]  (value not drawn)
P3  NC(HEADER 2)  [SIP2-2.54mm]
P4  HEADER 5x2  [IDC10-2.54mm]
P20  HEADER 2x2  [IDC4-2.54MM]  (value not drawn)
P21  HEADER 2x2  [IDC4-2.54MM]  (value not drawn)
R81  1K  [0402]
R82  10K  [0402]
R83  1K  [0402]
R84  1K  [0402]
U2  CH32V305F  [TSSOP20]

### Ports
3V3 (in), 5V (in), LINK (harness LINK), USB_LINK (harness USB_LINK)

### Harnesses
LINK: SWDIO, SWCLK, RST, LINK_RX
USB_LINK: USB_P, USB_N

### Nets
3V3: C30.1 D1.1(A) D2.1(A) P4.8 R82.2 U2.14(VDD33/VIO) ; port 3V3
5V: P4.10 ; port 5V
GND: C30.2 P3.2 P4.6 R84.1 U2.18(VSS/GND)
CLK: P20.2 ; port LINK.SWCLK
D_SWCLK: P4.2 P20.1 U2.6(PB13/SPI2_SCK/UART3_CTS/CAN2_TX) U2.15(PA14/SWCLK)  [also labelled PB13_305]
D_SWDIO: P4.4 P20.3 R81.1 U2.13(PA9/UART1_RTS/PA13/SWDIO)
DIO: P20.4 ; port LINK.SWDIO
IAP: IAP1.1(point) R82.1 U2.10(PC7)
LED_CON: R83.1 U2.12(PC9/PA8/UART1_RX)
NRST0: P4.9 P21.1 U2.11(PC8)
PC6_305: R81.2 U2.9(PC6)
PD0_305: U2.19(OSC_IN/PD0)
PD1_305: U2.20(OSC_OUT/PD1)
RST: P3.1 U2.1(RST#)
RST0: P21.2 ; port LINK.RST  [project net NRST]
TDI: P4.7 U2.8(PB15/SPI2_MOSI/UART1_TX)
TDO: P4.5 U2.7(PB14/SPI2_MISO/UART3_RTS)
TX1: P21.4 ; port LINK.LINK_RX
UART3_RX: P4.1 P21.3 U2.4(PB11/UART3_RX/I2C2_SDA)
UART3_TX: P4.3 U2.3(PB10/UART3_TX/I2C2_SCL)
USB_N: U2.16(PB6/USB2DM/UART1X_TX) ; port USB_LINK.USB_N
USB_P: U2.17(PB7/USB2DP/UART1X_RX) ; port USB_LINK.USB_P
NetD1_2: D1.2(K) R83.2
NetD2_2: D2.2(K) R84.2

Not connected (* = marked no-connect by the designer): U2 2(PA5/UART1_CTS/PA1_(no5V))* 5(PB12/SPI2_NSS/CAN2_RX)*

### Notes on the sheet
- LINK
- Blue light on -ARM Mode
- Blue light off-Risc-V Mode
- (in symbol CH32V305F) BOOT0=GND

### Library data of the parts
C30 = Cap: Capacitor
D1 D2 = D0603: Typical RED, GREEN, YELLOW, AMBER GaAs LED; Published: 8-Jun-2000; LatestRevisionDate: 17-Jul-2002; LatestRevisionNote: Re-released for DXP Platform.; PackageVersion: Feb-2002; PackageReference: 3.2X1.6X1.1; Publisher: Altium Limited; PackageDescription: SM LED; 2 Flat Leads
IAP1 = Testpoint: 测试点
P3 = HEADER 2: Header, 2-Pin
P4 = HEADER 5x2: Header, 5-Pin, Dual row
P20 P21 = HEADER 2x2: Header, 2-Pin, Dual row
R81-R84 = R0603: Resistor; Published: 8-Jun-2000; LatestRevisionDate: 17-Jul-2002; LatestRevisionNote: Re-released for DXP Platform.; PackageReference: AXIAL-0.3; Publisher: Altium Limited; PackageDescription: Axial Device, Thru-Hole; 2 Leads; 0.3 in Pin Spacing
U2 = CH32V305F: RISC-V FPU HD-MCU, 144MHz, USB_480M, CAN, UART*2, SPI

## Sheet QSPI.SchDoc
size A4; DocumentNumber: 5; SheetNumber: 5; SheetTotal: 15
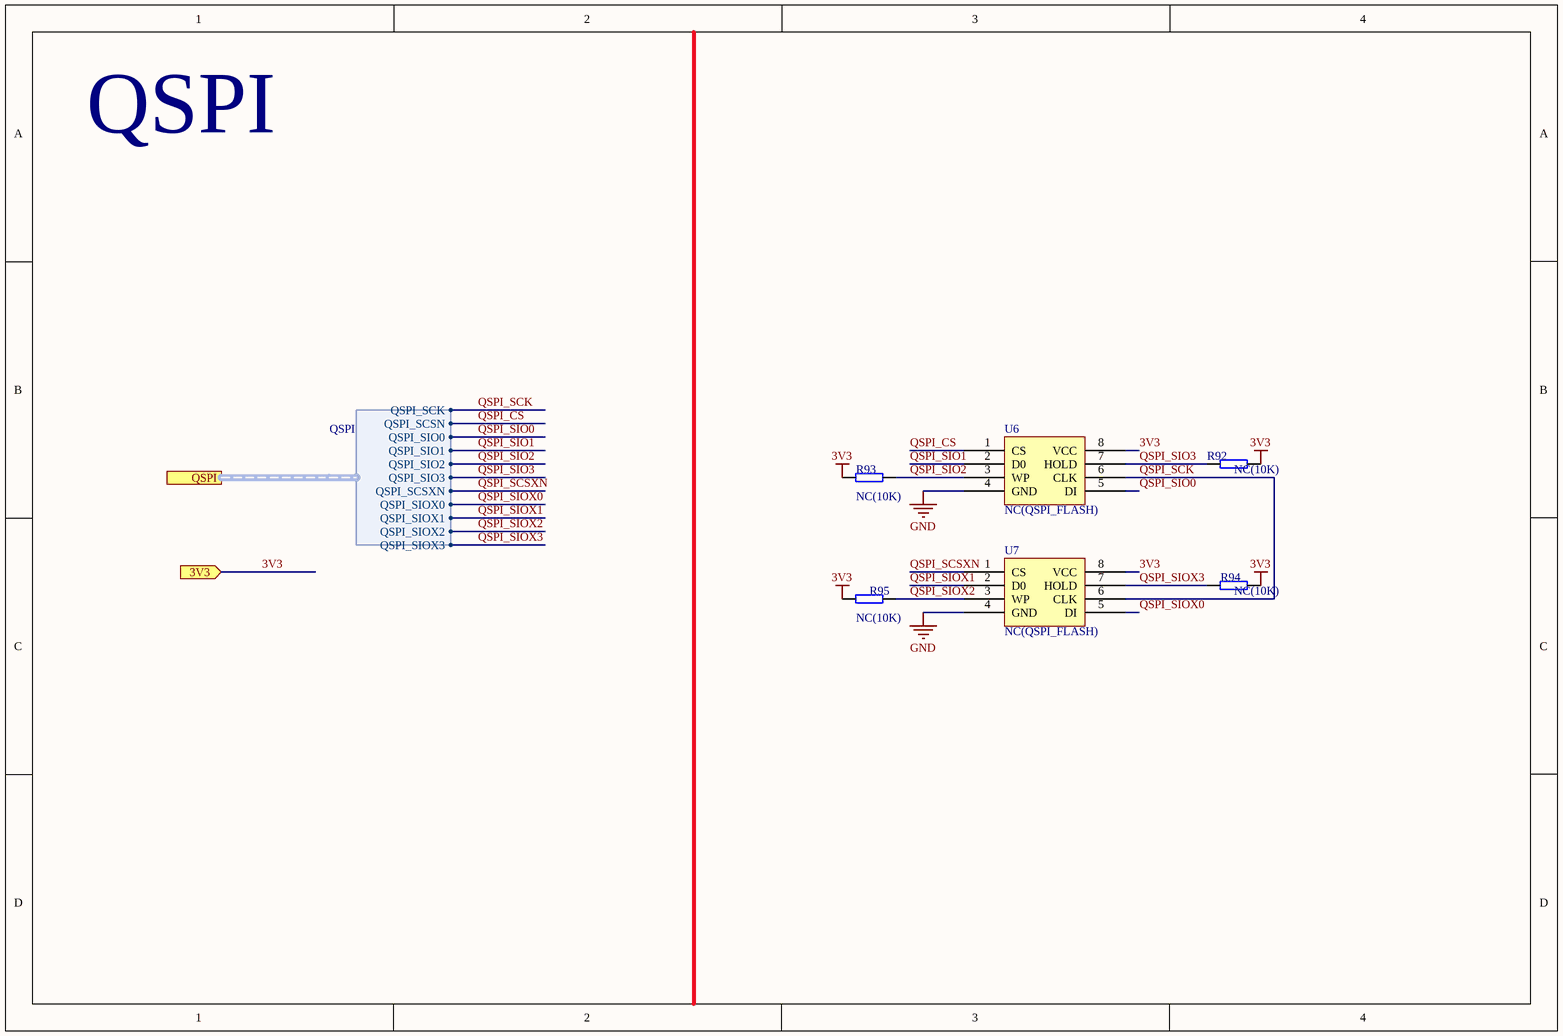
[diagram p4: QSPI.SchDoc]

### Parts
R92  NC(10K)  [0402]
R93  NC(10K)  [0402]
R94  NC(10K)  [0402]
R95  NC(10K)  [0402]
U6  NC(QSPI_FLASH)  [SOIC-8_208mil]
U7  NC(QSPI_FLASH)  [SOIC-8_208mil]

### Ports
3V3 (in), QSPI (harness QSPI)

### Harnesses
QSPI: QSPI_SCK, QSPI_SCSN, QSPI_SIO0, QSPI_SIO1, QSPI_SIO2, QSPI_SIO3, QSPI_SCSXN, QSPI_SIOX0, QSPI_SIOX1, QSPI_SIOX2, QSPI_SIOX3

### Nets
3V3: R92.1 R93.2 R94.1 R95.2 U6.8(VCC) U7.8(VCC) ; port 3V3
GND: U6.4(GND) U7.4(GND)
QSPI_CS: U6.1(CS) ; port QSPI.QSPI_SCSN
QSPI_SCK: U6.6(CLK) U7.6(CLK) ; port QSPI.QSPI_SCK
QSPI_SCSXN: U7.1(CS) ; port QSPI.QSPI_SCSXN
QSPI_SIO0: U6.5(DI) ; port QSPI.QSPI_SIO0
QSPI_SIO1: U6.2(D0) ; port QSPI.QSPI_SIO1
QSPI_SIO2: R93.1 U6.3(WP) ; port QSPI.QSPI_SIO2
QSPI_SIO3: R92.2 U6.7(HOLD) ; port QSPI.QSPI_SIO3
QSPI_SIOX0: U7.5(DI) ; port QSPI.QSPI_SIOX0
QSPI_SIOX1: U7.2(D0) ; port QSPI.QSPI_SIOX1
QSPI_SIOX2: R95.1 U7.3(WP) ; port QSPI.QSPI_SIOX2
QSPI_SIOX3: R94.2 U7.7(HOLD) ; port QSPI.QSPI_SIOX3

### Notes on the sheet
- QSPI

### Library data of the parts
R92-R95 = RES
U6 U7 = W25Q64

## Sheet SDRAM.SchDoc
size A4; DocumentNumber: 6; SheetNumber: 6; SheetTotal: 15
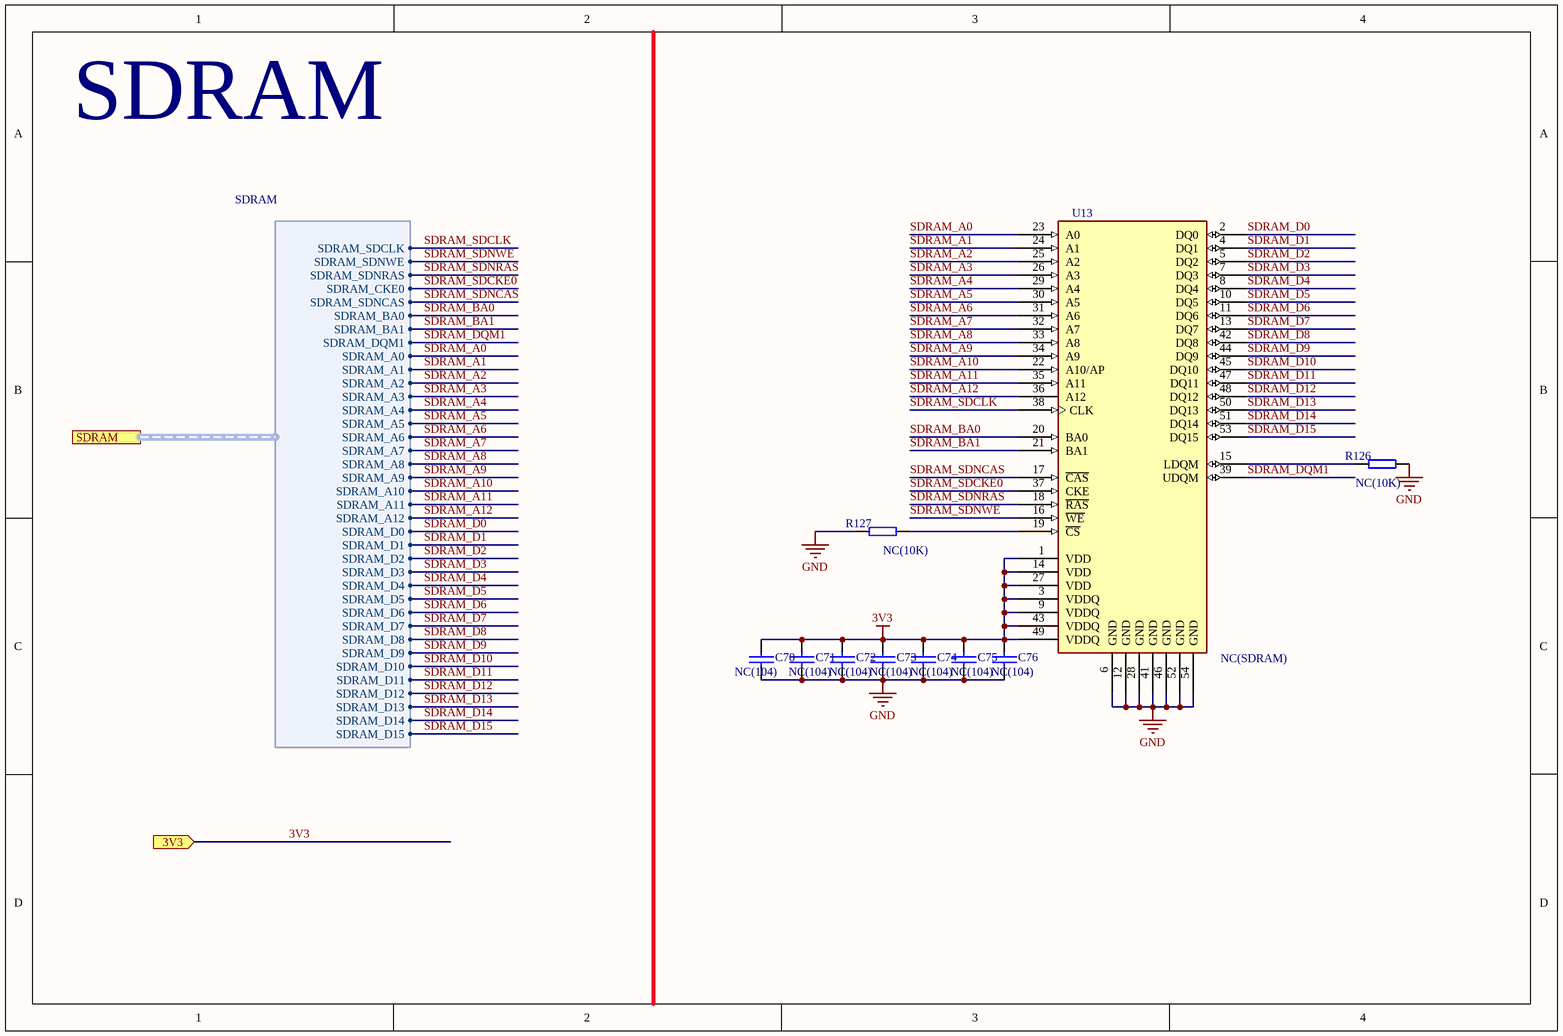
[diagram p5: SDRAM.SchDoc]

### Parts
C70  NC(104)  [0402_C]
C71  NC(104)  [0402_C]
C72  NC(104)  [0402_C]
C73  NC(104)  [0402_C]
C74  NC(104)  [0402_C]
C75  NC(104)  [0402_C]
C76  NC(104)  [0402_C]
R126  NC(10K)  [0402]
R127  NC(10K)  [0402]
U13  NC(SDRAM)  [TSOP-54]

### Ports
3V3 (in), SDRAM (harness SDRAM)

### Harnesses
SDRAM: SDRAM_SDNWE, SDRAM_SDNRAS, SDRAM_CKE0, SDRAM_SDNCAS, SDRAM_BA0, SDRAM_BA1, SDRAM_DQM1, SDRAM_A0, SDRAM_A1, SDRAM_A2, SDRAM_A3, SDRAM_A4, SDRAM_A5, SDRAM_A6, SDRAM_A7, SDRAM_A8, SDRAM_A9, SDRAM_A10, SDRAM_A11, SDRAM_A12, SDRAM_SDCLK, SDRAM_D0, SDRAM_D2, SDRAM_D3, SDRAM_D4, SDRAM_D5, SDRAM_D6, SDRAM_D7, SDRAM_D8, SDRAM_D9, SDRAM_D10, SDRAM_D11, SDRAM_D12, SDRAM_D13, SDRAM_D14, SDRAM_D15, SDRAM_D1

### Nets
3V3: C70.2 C71.2 C72.2 C73.2 C74.2 C75.2 C76.2 U13.1(VDD) U13.3(VDDQ) U13.9(VDDQ) U13.14(VDD) U13.27(VDD) U13.43(VDDQ) U13.49(VDDQ) ; port 3V3
GND: C70.1 C71.1 C72.1 C73.1 C74.1 C75.1 C76.1 R126.1 R127.2 U13.6(GND) U13.12(GND) U13.28(GND) U13.41(GND) U13.46(GND) U13.52(GND) U13.54(GND)
SDRAM_A0: U13.23(A0) ; port SDRAM.SDRAM_A0
SDRAM_A1: U13.24(A1) ; port SDRAM.SDRAM_A1
SDRAM_A2: U13.25(A2) ; port SDRAM.SDRAM_A2
SDRAM_A3: U13.26(A3) ; port SDRAM.SDRAM_A3
SDRAM_A4: U13.29(A4) ; port SDRAM.SDRAM_A4
SDRAM_A5: U13.30(A5) ; port SDRAM.SDRAM_A5
SDRAM_A6: U13.31(A6) ; port SDRAM.SDRAM_A6
SDRAM_A7: U13.32(A7) ; port SDRAM.SDRAM_A7
SDRAM_A8: U13.33(A8) ; port SDRAM.SDRAM_A8
SDRAM_A9: U13.34(A9) ; port SDRAM.SDRAM_A9
SDRAM_A10: U13.22(A10/AP) ; port SDRAM.SDRAM_A10
SDRAM_A11: U13.35(A11) ; port SDRAM.SDRAM_A11
SDRAM_A12: U13.36(A12) ; port SDRAM.SDRAM_A12
SDRAM_BA0: U13.20(BA0) ; port SDRAM.SDRAM_BA0
SDRAM_BA1: U13.21(BA1) ; port SDRAM.SDRAM_BA1
SDRAM_D0: U13.2(DQ0) ; port SDRAM.SDRAM_D0
SDRAM_D1: U13.4(DQ1) ; port SDRAM.SDRAM_D1
SDRAM_D2: U13.5(DQ2) ; port SDRAM.SDRAM_D2
SDRAM_D3: U13.7(DQ3) ; port SDRAM.SDRAM_D3
SDRAM_D4: U13.8(DQ4) ; port SDRAM.SDRAM_D4
SDRAM_D5: U13.10(DQ5) ; port SDRAM.SDRAM_D5
SDRAM_D6: U13.11(DQ6) ; port SDRAM.SDRAM_D6
SDRAM_D7: U13.13(DQ7) ; port SDRAM.SDRAM_D7
SDRAM_D8: U13.42(DQ8) ; port SDRAM.SDRAM_D8
SDRAM_D9: U13.44(DQ9) ; port SDRAM.SDRAM_D9
SDRAM_D10: U13.45(DQ10) ; port SDRAM.SDRAM_D10
SDRAM_D11: U13.47(DQ11) ; port SDRAM.SDRAM_D11
SDRAM_D12: U13.48(DQ12) ; port SDRAM.SDRAM_D12
SDRAM_D13: U13.50(DQ13) ; port SDRAM.SDRAM_D13
SDRAM_D14: U13.51(DQ14) ; port SDRAM.SDRAM_D14
SDRAM_D15: U13.53(DQ15) ; port SDRAM.SDRAM_D15
SDRAM_DQM1: U13.39(UDQM) ; port SDRAM.SDRAM_DQM1
SDRAM_SDCKE0: U13.37(CKE) ; port SDRAM.SDRAM_CKE0
SDRAM_SDCLK: U13.38(CLK) ; port SDRAM.SDRAM_SDCLK
SDRAM_SDNCAS: U13.17(~{CAS}) ; port SDRAM.SDRAM_SDNCAS
SDRAM_SDNRAS: U13.18(~{RAS}) ; port SDRAM.SDRAM_SDNRAS
SDRAM_SDNWE: U13.16(~{WE}) ; port SDRAM.SDRAM_SDNWE
NetR126_2: R126.2 U13.15(LDQM)
NetR127_1: R127.1 U13.19(~{CS})

### Notes on the sheet
- SDRAM

### Library data of the parts
C70-C76 = CAP: Capacitor
R126 R127 = RES
U13 = W9825G6KH-6

## Sheet LCD.SchDoc
size A4; DocumentNumber: 7; SheetNumber: 7; SheetTotal: 15
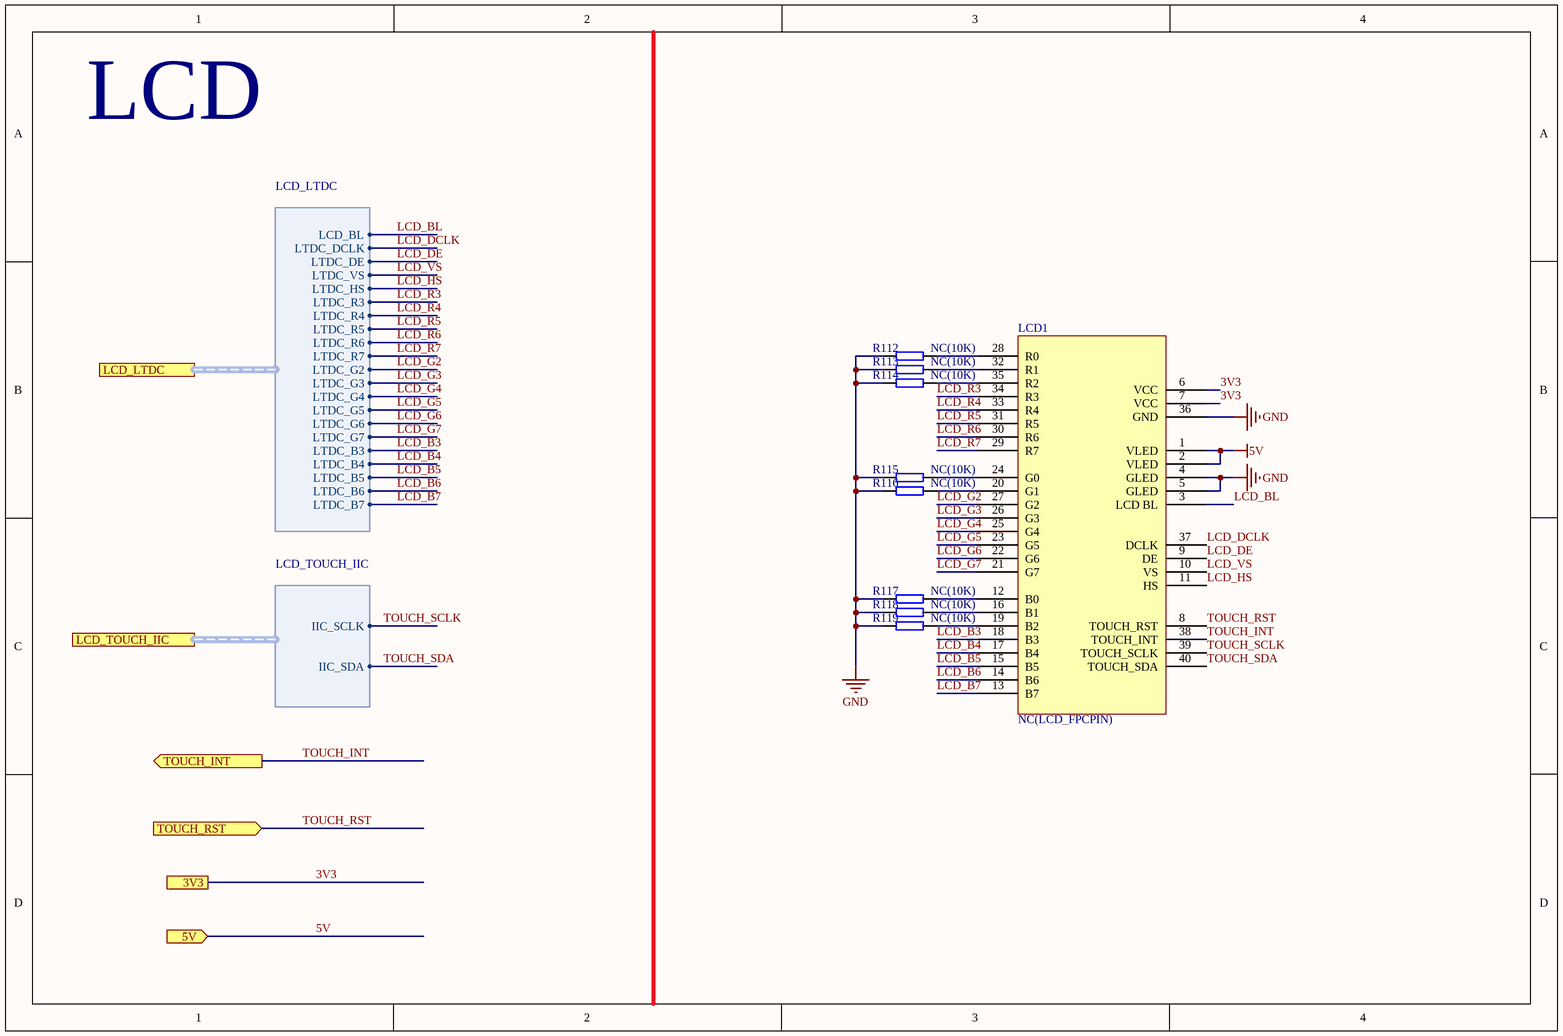
[diagram p6: LCD.SchDoc]

### Parts
LCD1  NC(LCD_FPCPIN)  [FPC40P-0.5-FK750M3]
R112  NC(10K)  [0402]
R113  NC(10K)  [0402]
R114  NC(10K)  [0402]
R115  NC(10K)  [0402]
R116  NC(10K)  [0402]
R117  NC(10K)  [0402]
R118  NC(10K)  [0402]
R119  NC(10K)  [0402]

### Ports
3V3, 5V (in), LCD_LTDC (harness LCD_LTDC), LCD_TOUCH_IIC (harness LCD_TOUCH_IIC), TOUCH_INT (out), TOUCH_RST (in)

### Harnesses
LCD_LTDC: LCD_BL, LTDC_DCLK, LTDC_DE, LTDC_VS, LTDC_HS, LTDC_R3, LTDC_R4, LTDC_R5, LTDC_R6, LTDC_R7, LTDC_G2, LTDC_G3, LTDC_G4, LTDC_G5, LTDC_G6, LTDC_G7, LTDC_B3, LTDC_B4, LTDC_B5, LTDC_B6, LTDC_B7
LCD_TOUCH_IIC: IIC_SCLK, IIC_SDA

### Nets
3V3: LCD1.6(VCC) LCD1.7(VCC) ; port 3V3
5V: LCD1.1(VLED) LCD1.2(VLED) ; port 5V
GND: LCD1.4(GLED) LCD1.5(GLED) LCD1.36(GND) R112.2 R113.2 R114.2 R115.2 R116.2 R117.2 R118.2 R119.2
LCD_B3: LCD1.18(B3) ; port LCD_LTDC.LTDC_B3
LCD_B4: LCD1.17(B4) ; port LCD_LTDC.LTDC_B4
LCD_B5: LCD1.15(B5) ; port LCD_LTDC.LTDC_B5
LCD_B6: LCD1.14(B6) ; port LCD_LTDC.LTDC_B6
LCD_B7: LCD1.13(B7) ; port LCD_LTDC.LTDC_B7
LCD_BL: LCD1.3(LCD_BL) ; port LCD_LTDC.LCD_BL
LCD_DCLK: LCD1.37(DCLK) ; port LCD_LTDC.LTDC_DCLK
LCD_DE: LCD1.9(DE) ; port LCD_LTDC.LTDC_DE
LCD_G2: LCD1.27(G2) ; port LCD_LTDC.LTDC_G2
LCD_G3: LCD1.26(G3) ; port LCD_LTDC.LTDC_G3
LCD_G4: LCD1.25(G4) ; port LCD_LTDC.LTDC_G4
LCD_G5: LCD1.23(G5) ; port LCD_LTDC.LTDC_G5
LCD_G6: LCD1.22(G6) ; port LCD_LTDC.LTDC_G6
LCD_G7: LCD1.21(G7) ; port LCD_LTDC.LTDC_G7
LCD_HS: LCD1.11(HS) ; port LCD_LTDC.LTDC_HS
LCD_R3: LCD1.34(R3) ; port LCD_LTDC.LTDC_R3
LCD_R4: LCD1.33(R4) ; port LCD_LTDC.LTDC_R4
LCD_R5: LCD1.31(R5) ; port LCD_LTDC.LTDC_R5
LCD_R6: LCD1.30(R6) ; port LCD_LTDC.LTDC_R6
LCD_R7: LCD1.29(R7) ; port LCD_LTDC.LTDC_R7
LCD_VS: LCD1.10(VS) ; port LCD_LTDC.LTDC_VS
TOUCH_INT: LCD1.38(TOUCH_INT) ; port TOUCH_INT
TOUCH_RST: LCD1.8(TOUCH_RST) ; port TOUCH_RST
TOUCH_SCLK: LCD1.39(TOUCH_SCLK) ; port LCD_TOUCH_IIC.IIC_SCLK  [project net IIC_SCL]
TOUCH_SDA: LCD1.40(TOUCH_SDA) ; port LCD_TOUCH_IIC.IIC_SDA  [project net IIC_SDA]
NetLCD1_12: LCD1.12(B0) R117.1
NetLCD1_16: LCD1.16(B1) R118.1
NetLCD1_19: LCD1.19(B2) R119.1
NetLCD1_20: LCD1.20(G1) R116.1
NetLCD1_24: LCD1.24(G0) R115.1
NetLCD1_28: LCD1.28(R0) R112.1
NetLCD1_32: LCD1.32(R1) R113.1
NetLCD1_35: LCD1.35(R2) R114.1

### Notes on the sheet
- LCD

### Library data of the parts
LCD1 = MY-RGB
R112-R119 = RES

## Sheet eMMC.SchDoc
size A4; DocumentNumber: 8; SheetNumber: 8; SheetTotal: 15
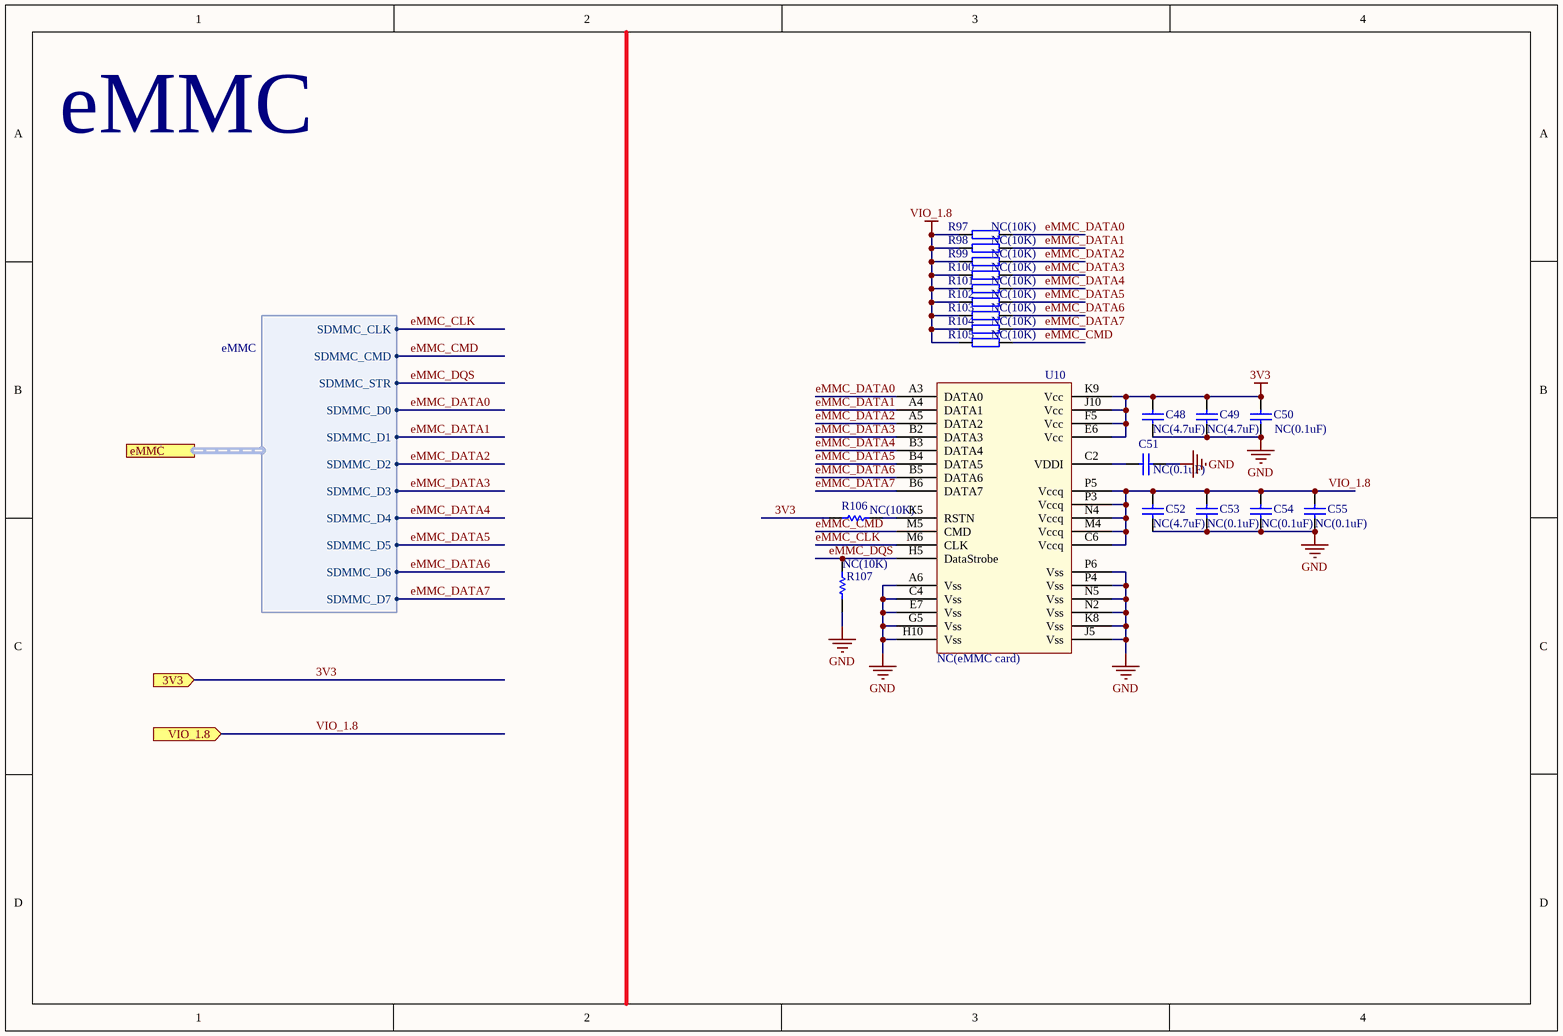
[diagram p7: eMMC.SchDoc]

### Parts
C48  NC(4.7uF)  [0402_C]
C49  NC(4.7uF)  [0402_C]
C50  NC(0.1uF)  [0402_C]
C51  NC(0.1uF)  [0402_C]
C52  NC(4.7uF)  [0402_C]
C53  NC(0.1uF)  [0402_C]
C54  NC(0.1uF)  [0402_C]
C55  NC(0.1uF)  [0402_C]
R97  NC(10K)  [0402]
R98  NC(10K)  [0402]
R99  NC(10K)  [0402]
R100  NC(10K)  [0402]
R101  NC(10K)  [0402]
R102  NC(10K)  [0402]
R103  NC(10K)  [0402]
R104  NC(10K)  [0402]
R105  NC(10K)  [0402]
R106  NC(10K)  [0402]
R107  NC(10K)  [0402]
U10  NC(eMMC card)  [WFBGA-153-11.5x13x0.8mm]

### Ports
3V3 (in), eMMC (harness eMMC), VIO_1.8 (in)

### Harnesses
eMMC: SDMMC_CLK, SDMMC_CMD, SDMMC_STR, SDMMC_D1, SDMMC_D0, SDMMC_D2, SDMMC_D3, SDMMC_D4, SDMMC_D5, SDMMC_D6, SDMMC_D7

### Nets
3V3: C48.2 C49.1 C50.1 R106.2 U10.E6(Vcc) U10.F5(Vcc) U10.J10(Vcc) U10.K9(Vcc) ; port 3V3
GND: C48.1 C49.2 C50.2 C51.1 C52.1 C53.2 C54.2 C55.2 R107.2 U10.A6(Vss) U10.C4(Vss) U10.E7(Vss) U10.G5(Vss) U10.H10(Vss) U10.J5(Vss) U10.K8(Vss) U10.N2(Vss) U10.N5(Vss) U10.P4(Vss) U10.P6(Vss)
VIO_1.8: C52.2 C53.1 C54.1 C55.1 R97.2 R98.2 R99.2 R100.2 R101.2 R102.2 R103.2 R104.2 R105.2 U10.C6(Vccq) U10.M4(Vccq) U10.N4(Vccq) U10.P3(Vccq) U10.P5(Vccq) ; port VIO_1.8
eMMC_CLK: U10.M6(CLK) ; port eMMC.SDMMC_CLK
eMMC_CMD: R105.1 U10.M5(CMD) ; port eMMC.SDMMC_CMD
eMMC_DATA0: R97.1 U10.A3(DATA0) ; port eMMC.SDMMC_D0
eMMC_DATA1: R98.1 U10.A4(DATA1) ; port eMMC.SDMMC_D1
eMMC_DATA2: R99.1 U10.A5(DATA2) ; port eMMC.SDMMC_D2
eMMC_DATA3: R100.1 U10.B2(DATA3) ; port eMMC.SDMMC_D3
eMMC_DATA4: R101.1 U10.B3(DATA4) ; port eMMC.SDMMC_D4
eMMC_DATA5: R102.1 U10.B4(DATA5) ; port eMMC.SDMMC_D5
eMMC_DATA6: R103.1 U10.B5(DATA6) ; port eMMC.SDMMC_D6
eMMC_DATA7: R104.1 U10.B6(DATA7) ; port eMMC.SDMMC_D7
eMMC_DQS: R107.1 U10.H5(DataStrobe) ; port eMMC.SDMMC_STR
NetC51_2: C51.2 U10.C2(VDDI)
NetR106_1: R106.1 U10.K5(RSTN)

### Notes on the sheet
- eMMC

### Library data of the parts
C48-C55 = Cap: Capacitor; Published: 8-Jun-2000; LatestRevisionDate: 17-Jul-2002; LatestRevisionNote: Re-released for DXP Platform.; PackageReference: RAD-0.3; Publisher: Altium Limited; PackageDescription: Radial Cap, Thru-Hole; 2 Leads; 0.3 in Pin Spacing
R97-R105 = RES
R106 R107 = Res1: Resistor; Published: 8-Jun-2000; LatestRevisionDate: 17-Jul-2002; LatestRevisionNote: Re-released for DXP Platform.; PackageReference: AXIAL-0.3; Publisher: Altium Limited; PackageDescription: Axial Device, Thru-Hole; 2 Leads; 0.3 in Pin Spacing
U10 = KLM8G1GETF-B041

## Sheet DVP.SchDoc
size A4; DocumentNumber: 9; SheetNumber: 9; SheetTotal: 15
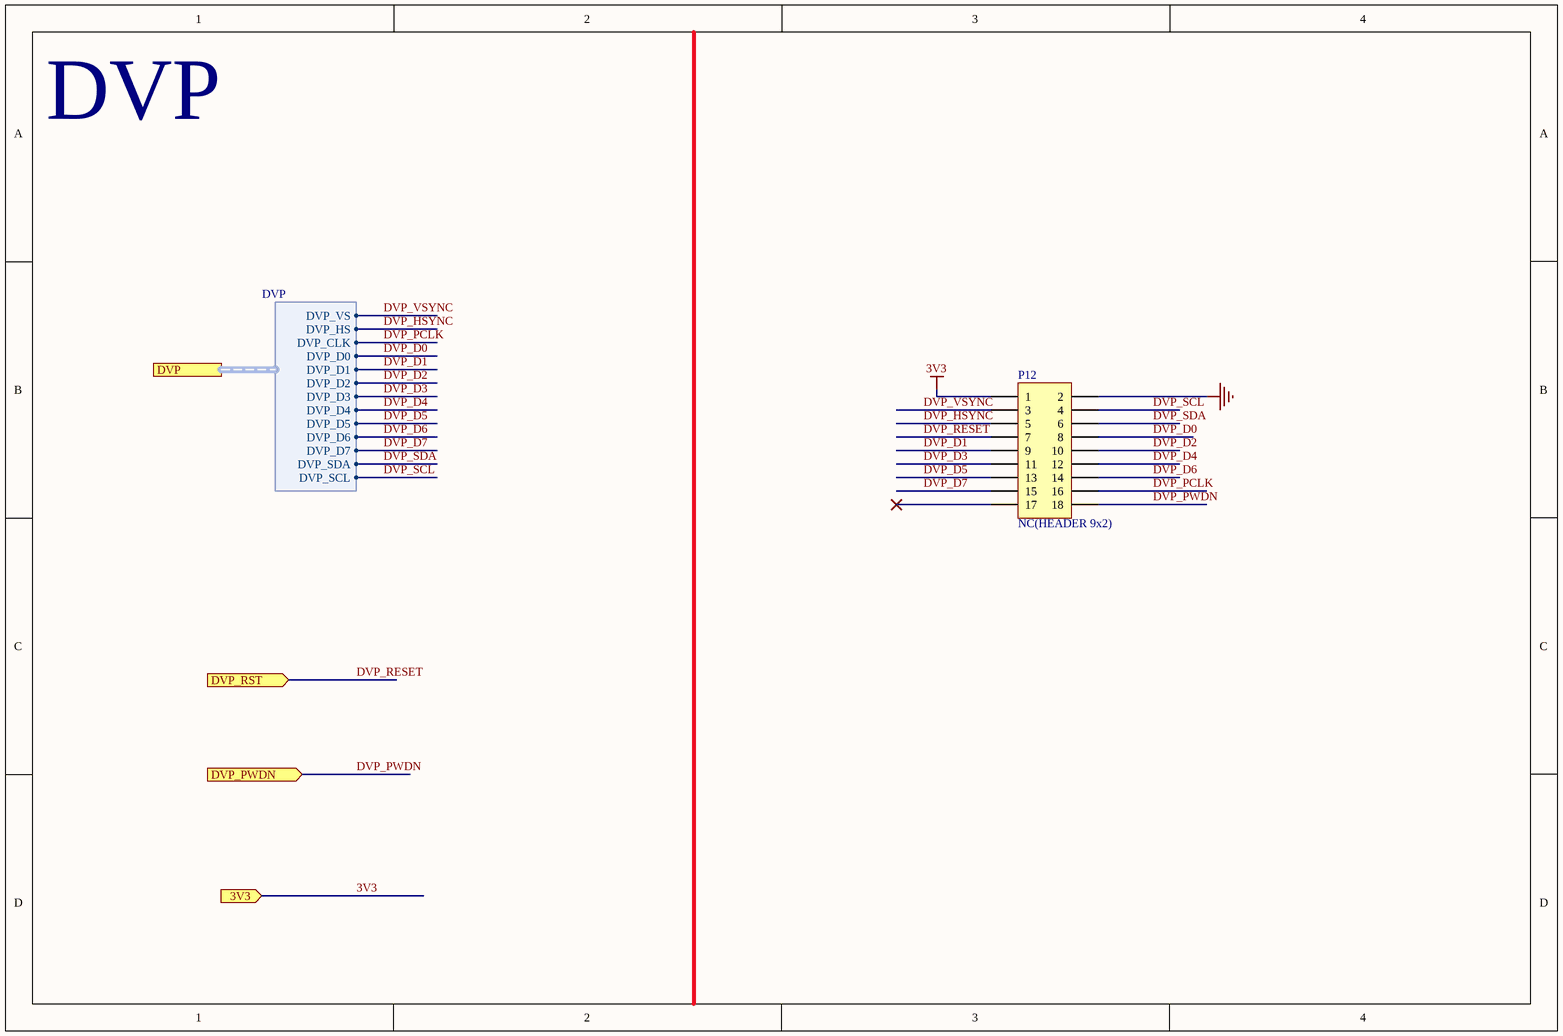
[diagram p8: DVP.SchDoc]

### Parts
P12  NC(HEADER 9x2)  [IDC18-2.54MM]

### Ports
3V3 (in), DVP (harness DVP), DVP_PWDN (in), DVP_RST (in)

### Harnesses
DVP: DVP_VS, DVP_HS, DVP_CLK, DVP_D0, DVP_D1, DVP_D2, DVP_D3, DVP_D4, DVP_D5, DVP_D6, DVP_D7, DVP_SDA, DVP_SCL

### Nets
3V3: P12.1 ; port 3V3
GND: P12.2
DVP_D0: P12.8 ; port DVP.DVP_D0
DVP_D1: P12.9 ; port DVP.DVP_D1
DVP_D2: P12.10 ; port DVP.DVP_D2
DVP_D3: P12.11 ; port DVP.DVP_D3
DVP_D4: P12.12 ; port DVP.DVP_D4
DVP_D5: P12.13 ; port DVP.DVP_D5
DVP_D6: P12.14 ; port DVP.DVP_D6
DVP_D7: P12.15 ; port DVP.DVP_D7
DVP_HSYNC: P12.5 ; port DVP.DVP_HS
DVP_PCLK: P12.16 ; port DVP.DVP_CLK
DVP_PWDN: P12.18 ; port DVP_PWDN
DVP_RESET: P12.7 ; port DVP_RST
DVP_SCL: P12.4 ; port DVP.DVP_SCL
DVP_SDA: P12.6 ; port DVP.DVP_SDA
DVP_VSYNC: P12.3 ; port DVP.DVP_VS

Not connected (* = marked no-connect by the designer): P12 17*

### Notes on the sheet
- DVP

### Library data of the parts
P12 = HEADER 9x2: Header, 9-Pin, Dual row

## Sheet ETH.SchDoc
size A4; DocumentNumber: 10; SheetNumber: 10; SheetTotal: 15
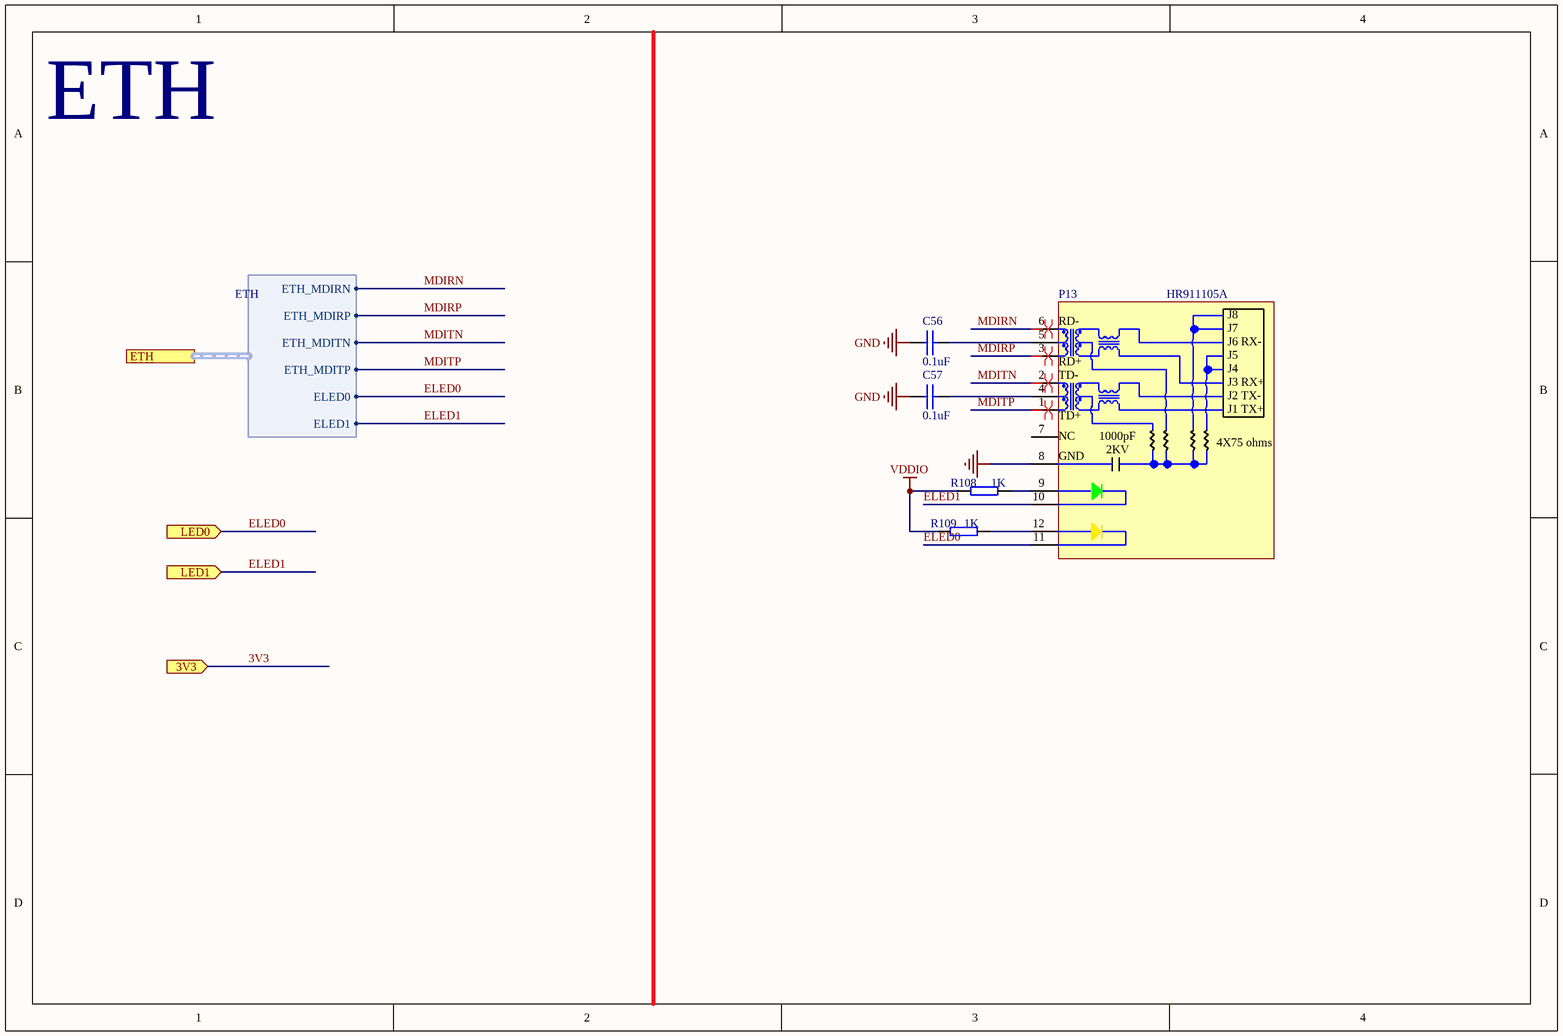
[diagram p9: ETH.SchDoc]

### Parts
C56  0.1uF  [0402_C]
C57  0.1uF  [0402_C]
P13  HR911105A  [HR911105A]
R108  1K  [0402]
R109  1K  [0402]

### Ports
3V3 (in), ETH (harness ETH), LED0 (in), LED1 (in)

### Harnesses
ETH: ETH_MDIRN, ETH_MDIRP, ETH_MDITN, ETH_MDITP, ELED0, ELED1

### Nets
GND: C56.1 C57.1 P13.8
VDDIO: R108.1 R109.1
ELED0: P13.11 ; port LED0, port ETH.ELED0
ELED1: P13.10 ; port LED1, port ETH.ELED1
MDIRN: P13.6 ; port ETH.ETH_MDIRN
MDIRP: P13.3 ; port ETH.ETH_MDIRP
MDITN: P13.2 ; port ETH.ETH_MDITN
MDITP: P13.1 ; port ETH.ETH_MDITP
NetC56_2: C56.2 P13.5
NetC57_2: C57.2 P13.4
NetP13_9: P13.9 R108.2
NetP13_12: P13.12 R109.2

Not connected (* = marked no-connect by the designer): P13 7

### Layout directives
differential pair: MDIRN, MDIRP, MDITN, MDITP

### Notes on the sheet
- ETH
- (in symbol HR911105A) J8; RD-; J7; J6; RX-; J5; RD+; J4; TD-; J3; RX+; J2; TX-; J1; TX+; TD+; NC; 1000pF; 4X75 ohms; 2KV; GND

### Library data of the parts
C56 C57 = CAP: Capacitor
R108 R109 = RES

## Sheet SAI.SchDoc
size A4; DocumentNumber: 11; SheetNumber: 11; SheetTotal: 15
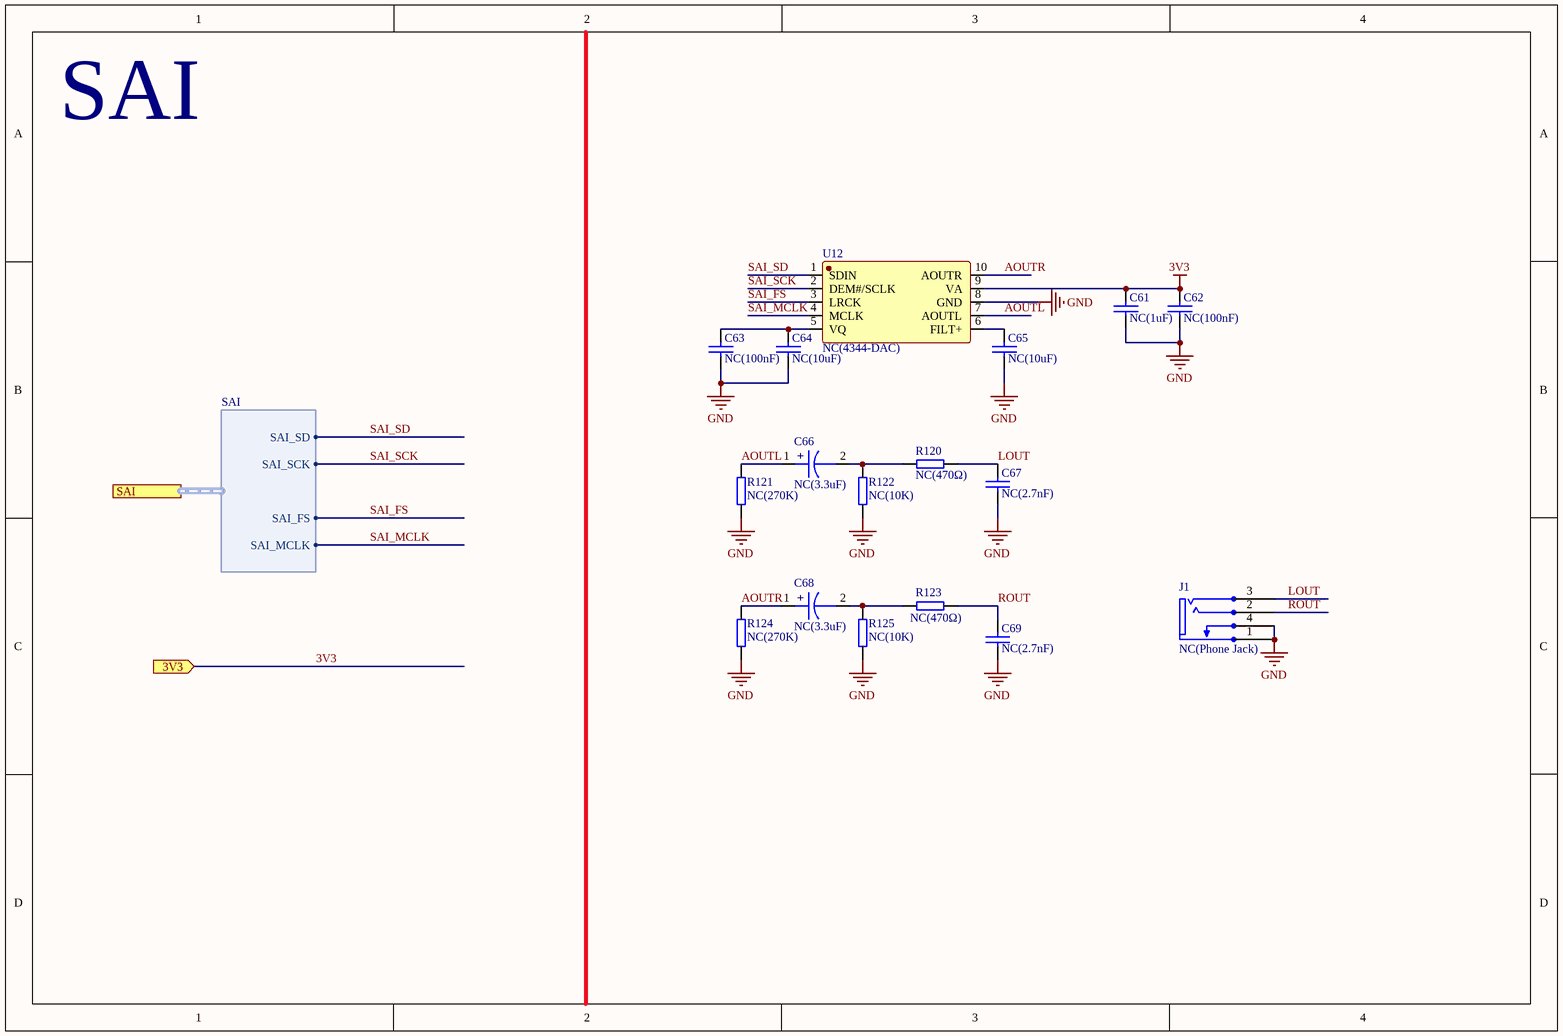
[diagram p10: SAI.SchDoc]

### Parts
C61  NC(1uF)  [0402_C]
C62  NC(100nF)  [0402_C]
C63  NC(100nF)  [0402_C]
C64  NC(10uF)  [0603_C]
C65  NC(10uF)  [0603_C]
C66  NC(3.3uF)  [CAP-TH_BD5.0-P2.00-D0.8-FD]
C67  NC(2.7nF)  [0402_C]
C68  NC(3.3uF)  [CAP-TH_BD5.0-P2.00-D0.8-FD]
C69  NC(2.7nF)  [0402_C]
J1  NC(Phone Jack)  [3.5MMEARPHONE]
R120  NC(470Ω)  [0402]
R121  NC(270K)  [0402]
R122  NC(10K)  [0402]
R123  NC(470Ω)  [0402]
R124  NC(270K)  [0402]
R125  NC(10K)  [0402]
U12  NC(4344-DAC)  [TSSOP-10_L3.0-W3.0-P0.50-LS4.9-BL]

### Ports
3V3 (in), SAI (harness SAI)

### Harnesses
SAI: SAI_SD, SAI_SCK, SAI_FS, SAI_MCLK

### Nets
3V3: C61.2 C62.2 U12.9(VA) ; port 3V3
GND: C61.1 C62.1 C63.1 C64.1 C65.1 C67.1 C69.1 J1.1 J1.4 R121.2 R122.2 R124.2 R125.2 U12.8(GND)
AOUTL: C66.1 R121.1 U12.7(AOUTL)
AOUTR: C68.1 R124.1 U12.10(AOUTR)
LOUT: C67.2 J1.3 R120.2
ROUT: C69.2 J1.2 R123.2
SAI_FS: U12.3(LRCK) ; port SAI.SAI_FS
SAI_MCLK: U12.4(MCLK) ; port SAI.SAI_MCLK
SAI_SCK: U12.2(DEM#/SCLK) ; port SAI.SAI_SCK
SAI_SD: U12.1(SDIN) ; port SAI.SAI_SD
NetC63_2: C63.2 C64.2 U12.5(VQ)
NetC65_2: C65.2 U12.6(FILT+)
NetC66_2: C66.2 R120.1 R122.1
NetC68_2: C68.2 R123.1 R125.1

### Notes on the sheet
- SAI
- (in symbol CAPACITOR POL) +

### Library data of the parts
C61-C65 C67 C69 = CAP: Capacitor
C66 C68 = CAPACITOR POL: 3.3uF
J1 = Phone Jack
R120-R125 = RES
U12 = CS4344-CZZ

## Sheet I3C.SchDoc
size A4; DocumentNumber: 12; SheetNumber: 12; SheetTotal: 15
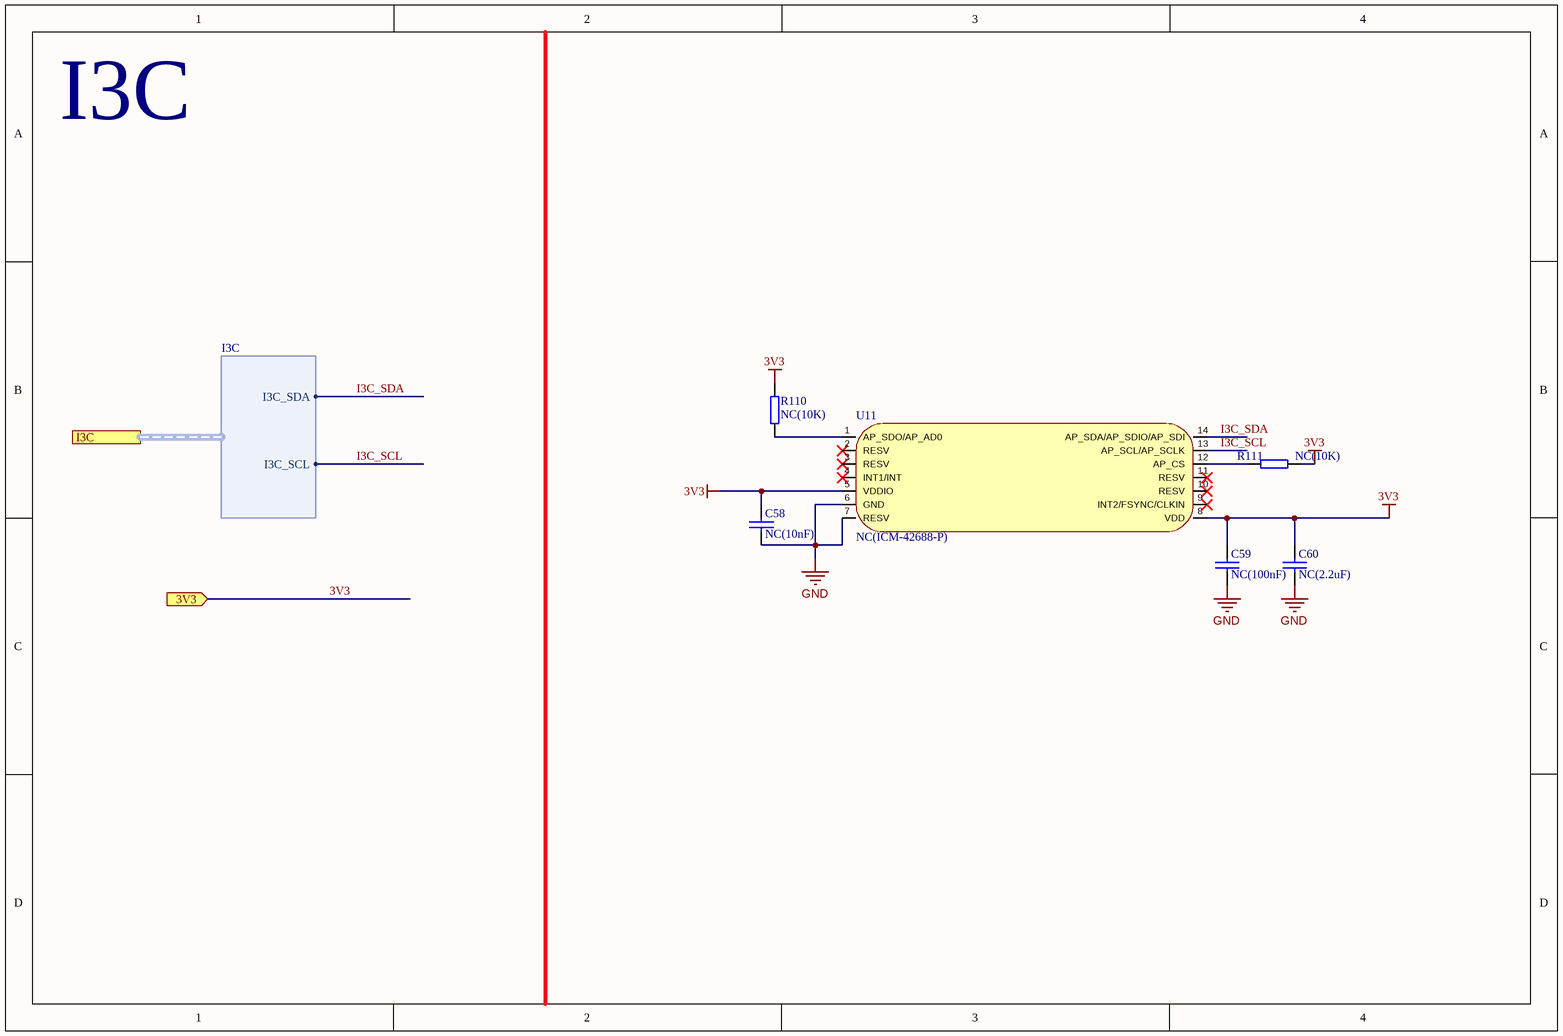
[diagram p11: I3C.SchDoc]

### Parts
C58  NC(10nF)  [0402_C]
C59  NC(100nF)  [0402_C]
C60  NC(2.2uF)  [0402_C]
R110  NC(10K)  [0402]
R111  NC(10K)  [0402]
U11  NC(ICM-42688-P)  [LGA-14_L3.0-W2.5-P0.50-TL]

### Ports
3V3 (in), I3C (harness I3C)

### Harnesses
I3C: I3C_SDA, I3C_SCL

### Nets
3V3: C58.2 C59.2 C60.2 R110.1 R111.1 U11.5(VDDIO) U11.8(VDD) ; port 3V3
GND: C58.1 C59.1 C60.1 U11.6(GND) U11.7(RESV)
I3C_SCL: U11.13(AP_SCL/AP_SCLK) ; port I3C.I3C_SCL
I3C_SDA: U11.14(AP_SDA/AP_SDIO/AP_SDI) ; port I3C.I3C_SDA
NetR110_2: R110.2 U11.1(AP_SDO/AP_AD0)
NetR111_2: R111.2 U11.12(AP_CS)

Not connected (* = marked no-connect by the designer): U11 2(RESV)* 3(RESV)* 4(INT1/INT)* 9(INT2/FSYNC/CLKIN)* 10(RESV)* 11(RESV)*

### Notes on the sheet
- I3C

### Library data of the parts
C58-C60 = CAP: Capacitor
R110 R111 = RES
U11 = ICM-42688-P

## Sheet DFSDM.SchDoc
size A4; DocumentNumber: 13; SheetNumber: 13; SheetTotal: 15
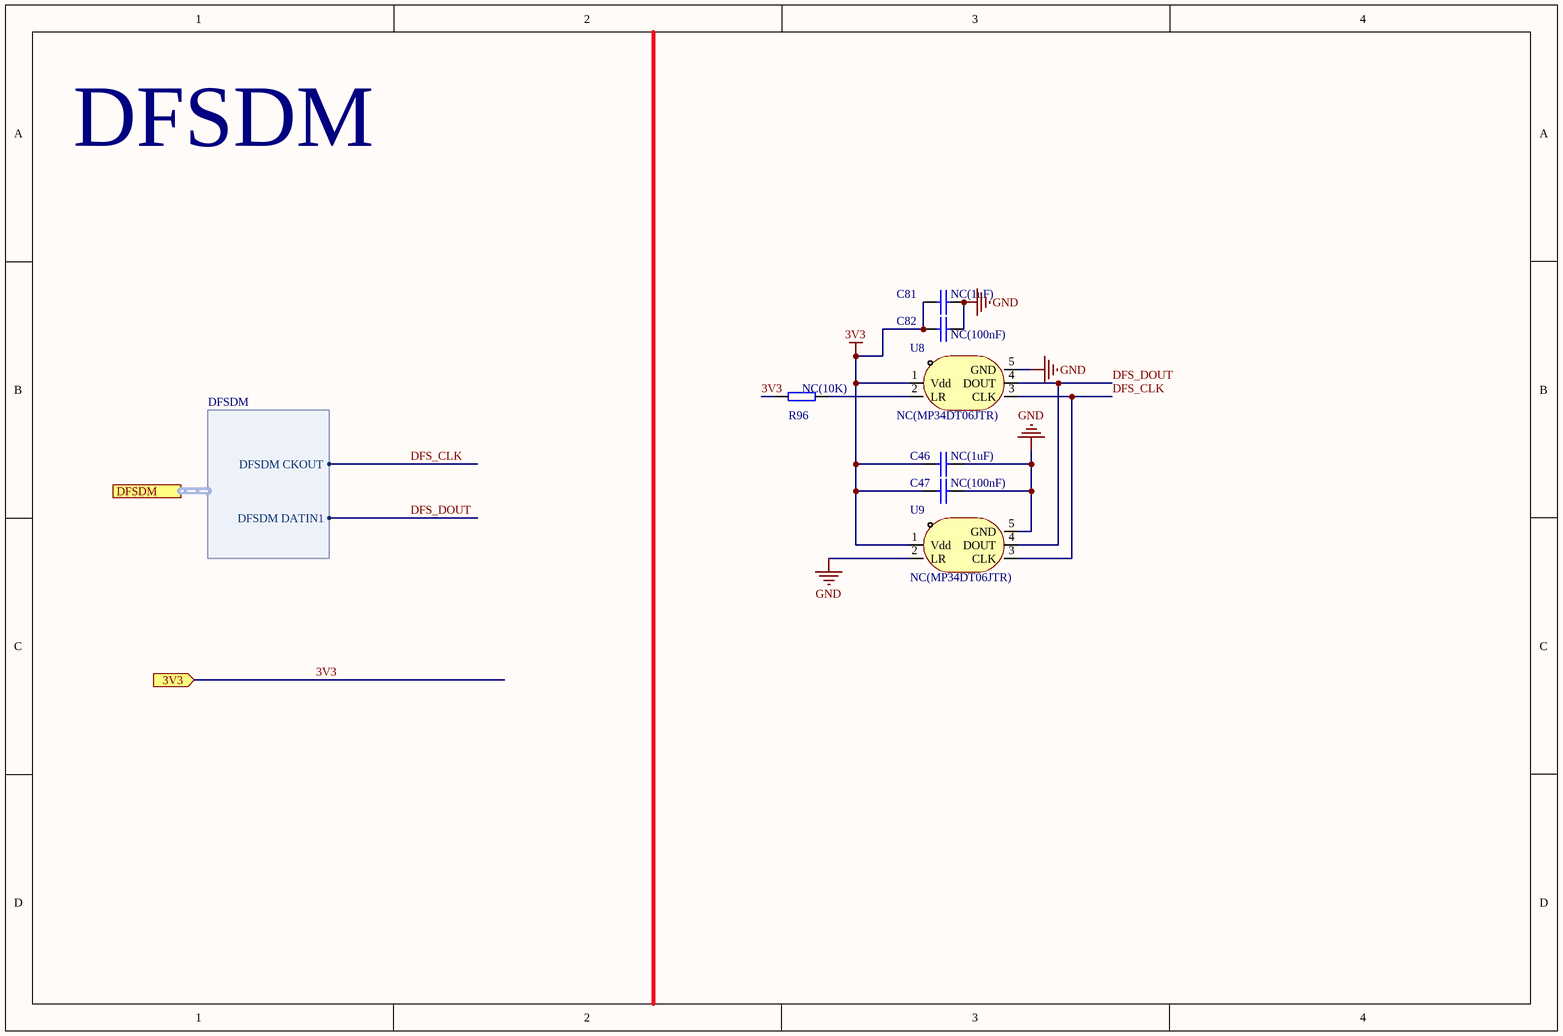
[diagram p12: DFSDM.SchDoc]

### Parts
C46  NC(1uF)  [0402_C]
C47  NC(100nF)  [0402_C]
C81  NC(1uF)  [0402_C]
C82  NC(100nF)  [0402_C]
R96  NC(10K)  [0402]
U8  NC(MP34DT06JTR)  [MIC-MP34DT06J-L3.0-W4.0-P0.85-1.35-BL]
U9  NC(MP34DT06JTR)  [MIC-MP34DT06J-L3.0-W4.0-P0.85-1.35-BL]

### Ports
3V3 (in), DFSDM (harness DFSDM)

### Harnesses
DFSDM: DFSDM CKOUT, DFSDM DATIN1

### Nets
3V3: C46.2 C47.2 C81.2 C82.2 R96.2 U8.1(Vdd) U9.1(Vdd) ; port 3V3
GND: C46.1 C47.1 C81.1 C82.1 U8.5(GND) U9.2(LR) U9.5(GND)
DFS_CLK: U8.3(CLK) U9.3(CLK) ; port DFSDM.DFSDM CKOUT
DFS_DOUT: U8.4(DOUT) U9.4(DOUT) ; port DFSDM.DFSDM DATIN1
NetR96_1: R96.1 U8.2(LR)

### Notes on the sheet
- DFSDM

### Library data of the parts
C46 C47 C81 C82 = CAP: Capacitor
R96 = RES
U8 U9 = MP34DT06JTR

## Sheet CAN.SchDoc
size A4; DocumentNumber: 14; SheetNumber: 14; SheetTotal: 15
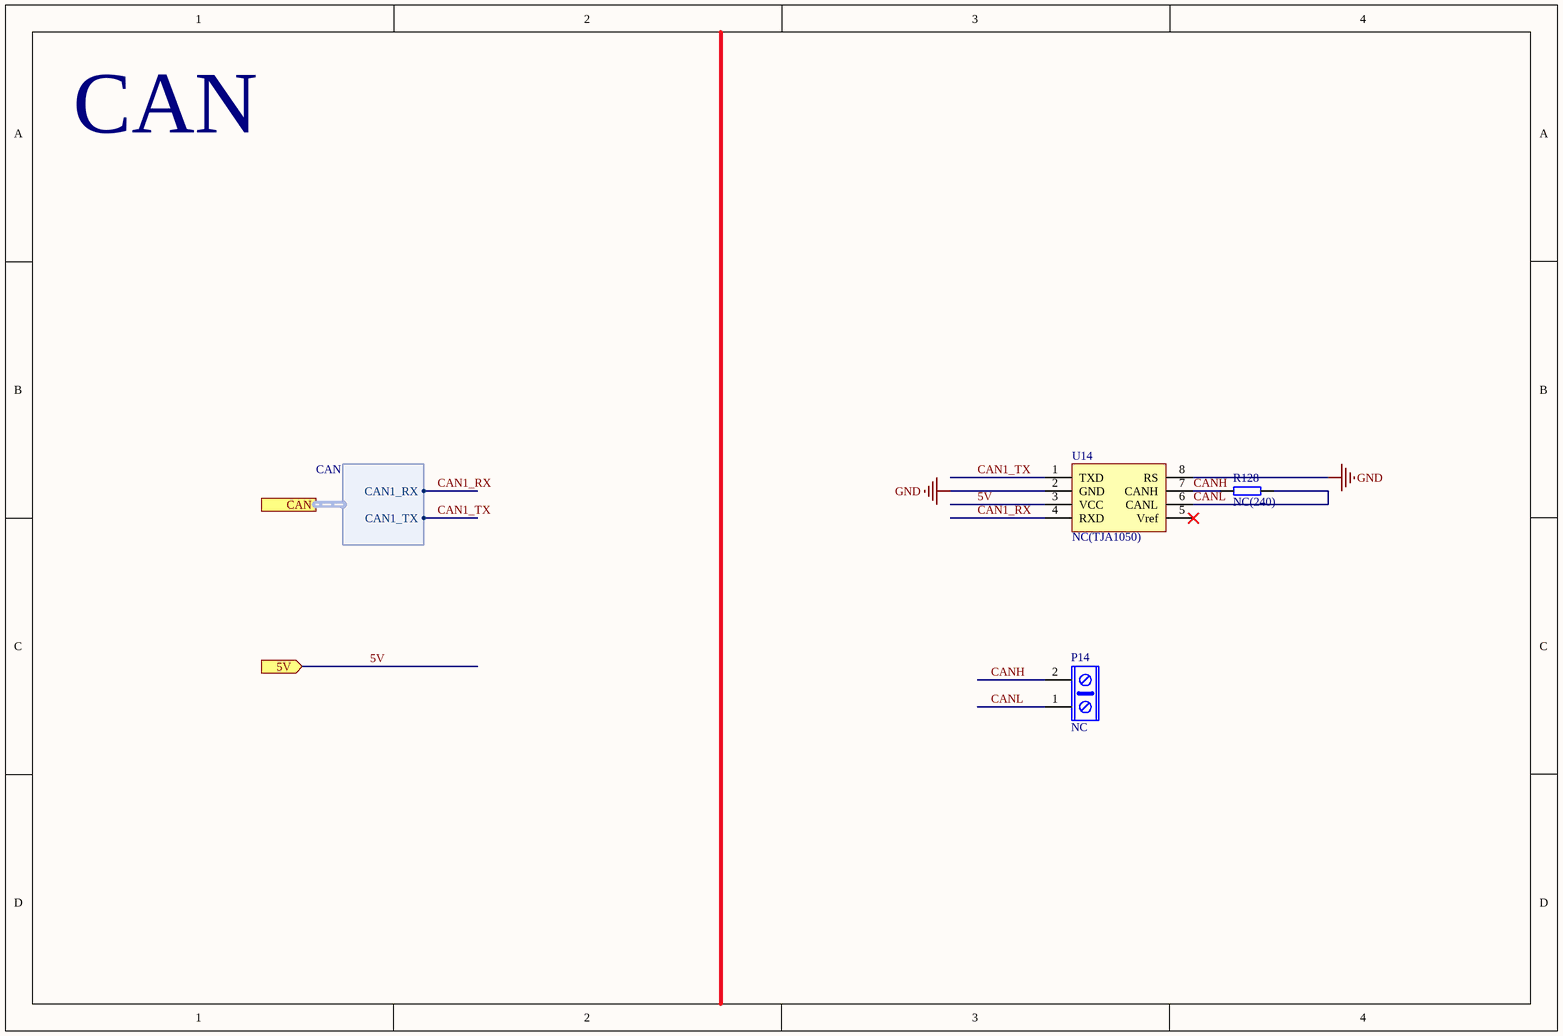
[diagram p13: CAN.SchDoc]

### Parts
P14  NC  [PORT2-5.08MM]
R128  NC(240)  [0402]
U14  NC(TJA1050)  [SOP8]

### Ports
5V (in), CAN (harness CAN)

### Harnesses
CAN: CAN1_TX, CAN1_RX

### Nets
5V: U14.3(VCC) ; port 5V
GND: U14.2(GND) U14.8(RS)
CAN1_RX: U14.4(RXD) ; port CAN.CAN1_RX
CAN1_TX: U14.1(TXD) ; port CAN.CAN1_TX
CANH: P14.2 R128.1 U14.7(CANH)
CANL: P14.1 R128.2 U14.6(CANL)

Not connected (* = marked no-connect by the designer): U14 5(Vref)*

### Notes on the sheet
- CAN

### Library data of the parts
P14 = 接线端子: 接线端子 2脚
R128 = RES
U14 = TJA1050: High speed CAN transceiver

## Sheet GPIO_OUT.SchDoc
size A4; DocumentNumber: 15; SheetNumber: 15; SheetTotal: 15
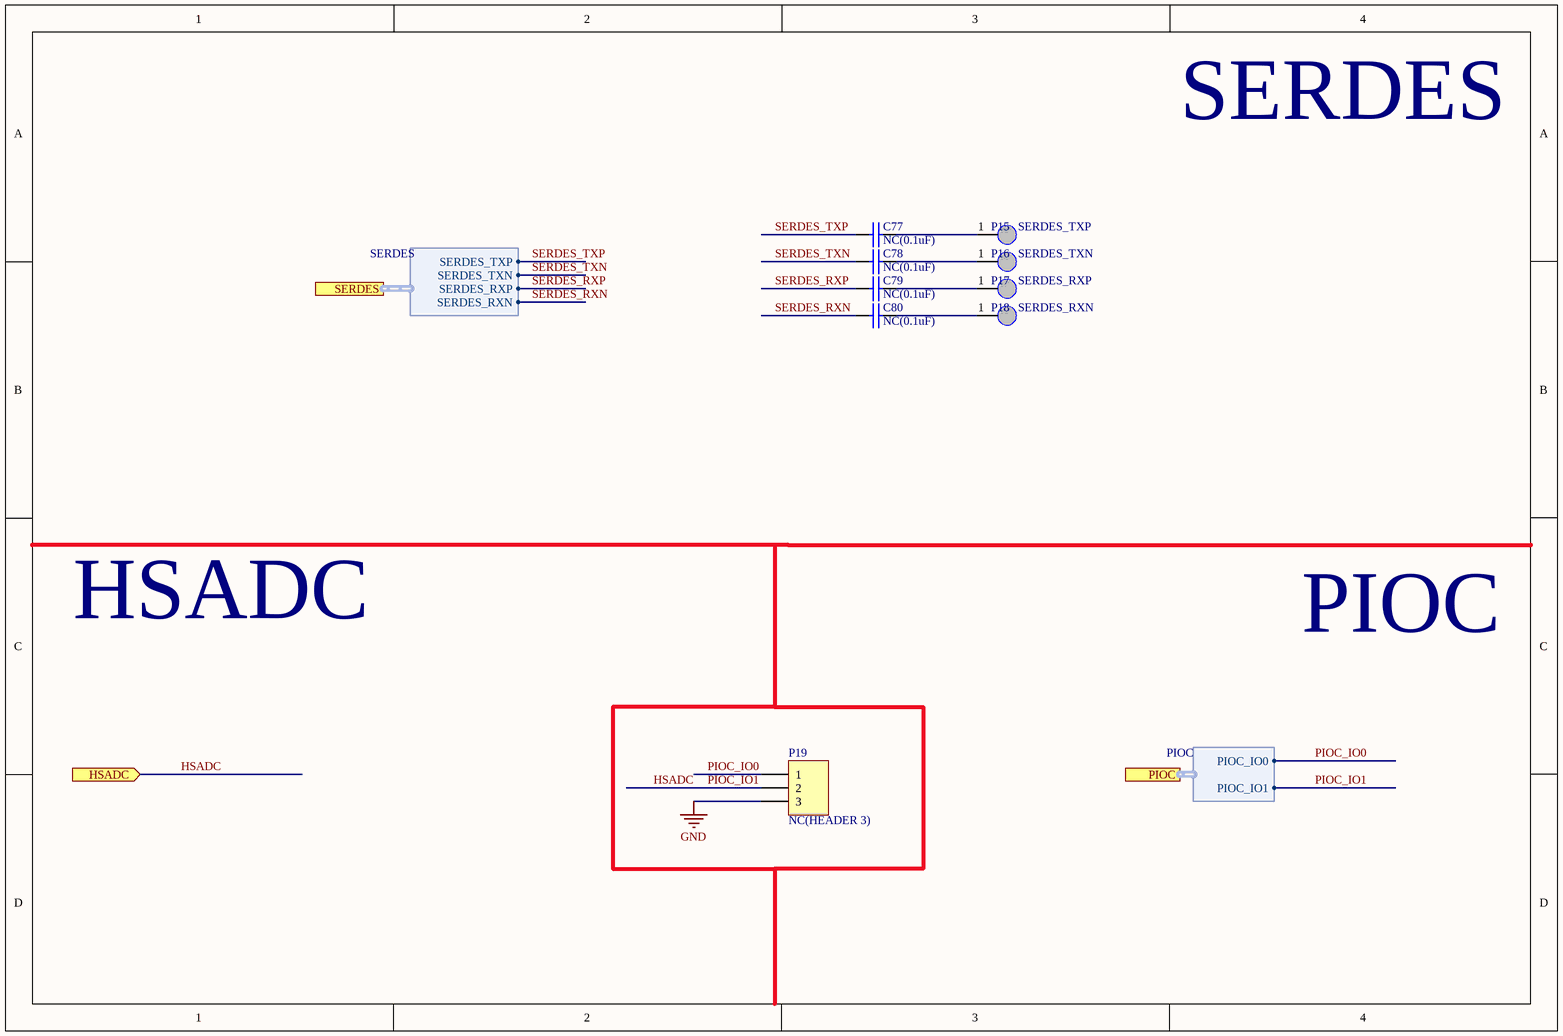
[diagram p14: GPIO_OUT.SchDoc]

### Parts
C77  NC(0.1uF)  [0402_C]
C78  NC(0.1uF)  [0402_C]
C79  NC(0.1uF)  [0402_C]
C80  NC(0.1uF)  [0402_C]
P15  SERDES_TXP  [TESTPOINT1]
P16  SERDES_TXN  [TESTPOINT1]
P17  SERDES_RXP  [TESTPOINT1]
P18  SERDES_RXN  [TESTPOINT1]
P19  NC(HEADER 3)  [SIP3-2.54MM]

### Ports
HSADC (in), PIOC (harness PIOC), SERDES (harness SERDES)

### Harnesses
PIOC: PIOC_IO0, PIOC_IO1
SERDES: SERDES_TXP, SERDES_TXN, SERDES_RXP, SERDES_RXN

### Nets
GND: P19.3
HSADC: P19.2 ; port HSADC, port PIOC.PIOC_IO1  [also labelled PIOC_IO1]
PIOC_IO0: P19.1 ; port PIOC.PIOC_IO0
SERDES_RXN: C80.1 ; port SERDES.SERDES_RXN
SERDES_RXP: C79.1 ; port SERDES.SERDES_RXP
SERDES_TXN: C78.1 ; port SERDES.SERDES_TXN
SERDES_TXP: C77.1 ; port SERDES.SERDES_TXP
NetC77_2: C77.2 P15.1
NetC78_2: C78.2 P16.1
NetC79_2: C79.2 P17.1
NetC80_2: C80.2 P18.1

### Notes on the sheet
- SERDES
- HSADC
- PIOC

### Library data of the parts
C77-C80 = CAP: Capacitor
P15-P18 = PAD: 焊盘
P19 = HEADER 3: Header, 3-Pin

## Nets that join several sheets
1V2: POWER (C36.2 C37.2 L2.2 U4.6), IOS (R27.2 R29.2)
3V3: POWER (D3.1 P5.2), IOS (8 pins), LINK (6 pins), QSPI (6 pins), SDRAM (14 pins), LCD (LCD1.6 LCD1.7), eMMC (8 pins), DVP (P12.1), SAI (C61.2 C62.2 U12.9), I3C (7 pins), DFSDM (7 pins)
5V: POWER (8 pins), LINK (P4.10), LCD (LCD1.1 LCD1.2), CAN (U14.3)
GND: POWER (31 pins), IOS (36 pins), LINK (5 pins), QSPI (U6.4 U7.4), SDRAM (16 pins), LCD (11 pins), eMMC (20 pins), DVP (P12.2), ETH (C56.1 C57.1 P13.8), SAI (14 pins), I3C (5 pins), DFSDM (7 pins), CAN (U14.2 U14.8), GPIO_OUT (P19.3)
VDDIO: IOS (17 pins), ETH (R108.1 R109.1)
VIO_1.8: IOS (8 pins), eMMC (18 pins)
CAN1_RX: IOS (R77.1), CAN (U14.4)
CAN1_TX: IOS (R80.1), CAN (U14.1)
CC1: POWER (P10.A5 R90.1), IOS (R51.1)
CC2: POWER (P10.B5 R91.1), IOS (R53.1)
CLK: POWER (P7.3), IOS (U1.120), LINK (P20.2)
DFS_CLK: IOS (U1.45), DFSDM (U8.3 U9.3)
DFS_DOUT: IOS (U1.65), DFSDM (U8.4 U9.4)
DIO: POWER (P7.2), IOS (U1.121), LINK (P20.4)
DVP_D0: IOS (R13.1), DVP (P12.8)
DVP_D1: IOS (R16.1), DVP (P12.9)
DVP_D2: IOS (R19.1), DVP (P12.10)
DVP_D3: IOS (R23.1), DVP (P12.11)
DVP_D4: IOS (R56.1), DVP (P12.12)
DVP_D5: IOS (U1.113), DVP (P12.13)
DVP_D6: IOS (R58.1), DVP (P12.14)
DVP_D7: IOS (R60.1), DVP (P12.15)
DVP_HSYNC: IOS (U1.39), DVP (P12.5)
DVP_PCLK: IOS (U1.50), DVP (P12.16)
DVP_PWDN: IOS (R44.1), DVP (P12.18)
DVP_RESET: IOS (R1.1), DVP (P12.7)
DVP_SCL: IOS (U1.43), DVP (P12.4)
DVP_SDA: IOS (R74.1), DVP (P12.6)
DVP_VSYNC: IOS (R79.1), DVP (P12.3)
ELED0: IOS (P1.1 R10.1), ETH (P13.11)
ELED1: IOS (P1.4 R12.1), ETH (P13.10)
eMMC_CLK: IOS (R41.1), eMMC (U10.M6)
eMMC_CMD: IOS (R43.1), eMMC (R105.1 U10.M5)
eMMC_DATA0: IOS (R21.1), eMMC (R97.1 U10.A3)
eMMC_DATA1: IOS (R24.1), eMMC (R98.1 U10.A4)
eMMC_DATA2: IOS (R34.1), eMMC (R99.1 U10.A5)
eMMC_DATA3: IOS (R38.1), eMMC (R100.1 U10.B2)
eMMC_DATA4: IOS (R26.1), eMMC (R101.1 U10.B3)
eMMC_DATA5: IOS (R30.1), eMMC (R102.1 U10.B4)
eMMC_DATA6: IOS (R14.1), eMMC (R103.1 U10.B5)
eMMC_DATA7: IOS (R18.1), eMMC (R104.1 U10.B6)
eMMC_DQS: IOS (R45.1), eMMC (R107.1 U10.H5)
HSADC: IOS (R63.1), GPIO_OUT (P19.2)
I3C_SCL: IOS (R6.1 R22.2), I3C (U11.13)
I3C_SDA: IOS (R8.1 R20.1), I3C (U11.14)
IIC_SCL: IOS (R9.1 R15.1), LCD (LCD1.39)
IIC_SDA: IOS (R17.2 R72.1), LCD (LCD1.40)
LCD_B3: IOS (U1.107), LCD (LCD1.18)
LCD_B4: IOS (U1.111), LCD (LCD1.17)
LCD_B5: IOS (U1.37), LCD (LCD1.15)
LCD_B6: IOS (R28.1), LCD (LCD1.14)
LCD_B7: IOS (R42.1), LCD (LCD1.13)
LCD_BL: IOS (U1.117), LCD (LCD1.3)
LCD_DCLK: IOS (U1.78), LCD (LCD1.37)
LCD_DE: IOS (U1.44), LCD (LCD1.9)
LCD_G2: IOS (U1.41), LCD (LCD1.27)
LCD_G3: IOS (U1.106), LCD (LCD1.26)
LCD_G4: IOS (U1.61), LCD (LCD1.25)
LCD_G5: IOS (R66.1), LCD (LCD1.23)
LCD_G6: IOS (U1.109), LCD (LCD1.22)
LCD_G7: IOS (U1.68), LCD (LCD1.21)
LCD_HS: IOS (R32.1), LCD (LCD1.11)
LCD_R3: IOS (U1.99), LCD (LCD1.34)
LCD_R4: IOS (U1.40), LCD (LCD1.33)
LCD_R5: IOS (U1.88), LCD (LCD1.31)
LCD_R6: IOS (U1.87), LCD (LCD1.30)
LCD_R7: IOS (U1.103), LCD (LCD1.29)
LCD_VS: IOS (R36.1), LCD (LCD1.10)
MDIRN: IOS (U1.12), ETH (P13.6)
MDIRP: IOS (U1.13), ETH (P13.3)
MDITN: IOS (U1.14), ETH (P13.2)
MDITP: IOS (U1.15), ETH (P13.1)
NRST: IOS (C19.2 S2.1 U1.25), LINK (P21.2)
OTG_FS_DM: POWER (P10.A7 P10.B7), IOS (R47.1)
OTG_FS_DP: POWER (P10.A6 P10.B6), IOS (R49.1)
PIOC_IO0: IOS (R65.1), GPIO_OUT (P19.1)
QSPI_CS: IOS (R7.1), QSPI (U6.1)
QSPI_SCK: IOS (R5.1), QSPI (U6.6 U7.6)
QSPI_SCSXN: IOS (R67.1), QSPI (U7.1)
QSPI_SIO0: IOS (U1.19), QSPI (U6.5)
QSPI_SIO1: IOS (U1.20), QSPI (U6.2)
QSPI_SIO2: IOS (U1.21), QSPI (R93.1 U6.3)
QSPI_SIO3: IOS (R62.1), QSPI (R92.2 U6.7)
QSPI_SIOX0: IOS (R69.1), QSPI (U7.5)
QSPI_SIOX1: IOS (R71.1), QSPI (U7.2)
QSPI_SIOX2: IOS (R73.1), QSPI (R95.1 U7.3)
QSPI_SIOX3: IOS (R75.1), QSPI (R94.2 U7.7)
SAI_FS: IOS (R70.1), SAI (U12.3)
SAI_MCLK: IOS (U1.1), SAI (U12.4)
SAI_SCK: IOS (R68.1), SAI (U12.2)
SAI_SD: IOS (U1.47), SAI (U12.1)
SDRAM_A0: IOS (U1.110), SDRAM (U13.23)
SDRAM_A1: IOS (R50.1), SDRAM (U13.24)
SDRAM_A2: IOS (R52.1), SDRAM (U13.25)
SDRAM_A3: IOS (U1.59), SDRAM (U13.26)
SDRAM_A4: IOS (U1.112), SDRAM (U13.29)
SDRAM_A5: IOS (R76.1), SDRAM (U13.30)
SDRAM_A6: IOS (U1.62), SDRAM (U13.31)
SDRAM_A7: IOS (R46.1), SDRAM (U13.32)
SDRAM_A8: IOS (R48.1), SDRAM (U13.33)
SDRAM_A9: IOS (U1.67), SDRAM (U13.34)
SDRAM_A10: IOS (U1.71), SDRAM (U13.22)
SDRAM_A11: IOS (U1.72), SDRAM (U13.35)
SDRAM_A12: IOS (U1.73), SDRAM (U13.36)
SDRAM_BA0: IOS (U1.46), SDRAM (U13.20)
SDRAM_BA1: IOS (U1.92), SDRAM (U13.21)
SDRAM_D0: IOS (U1.74), SDRAM (U13.2)
SDRAM_D1: IOS (U1.75), SDRAM (U13.4)
SDRAM_D2: IOS (U1.76), SDRAM (U13.5)
SDRAM_D3: IOS (U1.100), SDRAM (U13.7)
SDRAM_D4: IOS (U1.52), SDRAM (U13.8)
SDRAM_D5: IOS (U1.53), SDRAM (U13.10)
SDRAM_D6: IOS (U1.54), SDRAM (U13.11)
SDRAM_D7: IOS (U1.55), SDRAM (U13.13)
SDRAM_D8: IOS (U1.56), SDRAM (U13.42)
SDRAM_D9: IOS (U1.57), SDRAM (U13.44)
SDRAM_D10: IOS (U1.58), SDRAM (U13.45)
SDRAM_D11: IOS (U1.89), SDRAM (U13.47)
SDRAM_D12: IOS (U1.60), SDRAM (U13.48)
SDRAM_D13: IOS (U1.69), SDRAM (U13.50)
SDRAM_D14: IOS (U1.70), SDRAM (U13.51)
SDRAM_D15: IOS (U1.104), SDRAM (U13.53)
SDRAM_DQM1: IOS (R54.1), SDRAM (U13.39)
SDRAM_SDCKE0: IOS (U1.108), SDRAM (U13.37)
SDRAM_SDCLK: IOS (R11.1), SDRAM (U13.38)
SDRAM_SDNCAS: IOS (U1.49), SDRAM (U13.17)
SDRAM_SDNRAS: IOS (U1.48), SDRAM (U13.18)
SDRAM_SDNWE: IOS (U1.42), SDRAM (U13.16)
SERDES_RXN: IOS (R61.1), GPIO_OUT (C80.1)
SERDES_RXP: IOS (R59.1), GPIO_OUT (C79.1)
SERDES_TXN: IOS (R57.1), GPIO_OUT (C78.1)
SERDES_TXP: IOS (R55.1), GPIO_OUT (C77.1)
TOUCH_INT: IOS (R3.1), LCD (LCD1.38)
TOUCH_RST: IOS (R25.1), LCD (LCD1.8)
TX1: IOS (R64.1), LINK (P21.4)
USB_N: POWER (P11.A7 P11.B7), LINK (U2.16)
USB_P: POWER (P11.A6 P11.B6), LINK (U2.17)
USBSS_RXN: POWER (P7.6), IOS (U1.126)
USBSS_RXP: POWER (P7.5), IOS (U1.127)
USBSS_TXN: POWER (C45.2), IOS (U1.123)
USBSS_TXP: POWER (C44.2), IOS (U1.124)